# Altium project MAINBOARD.PrjPcb (part 1 of 2)
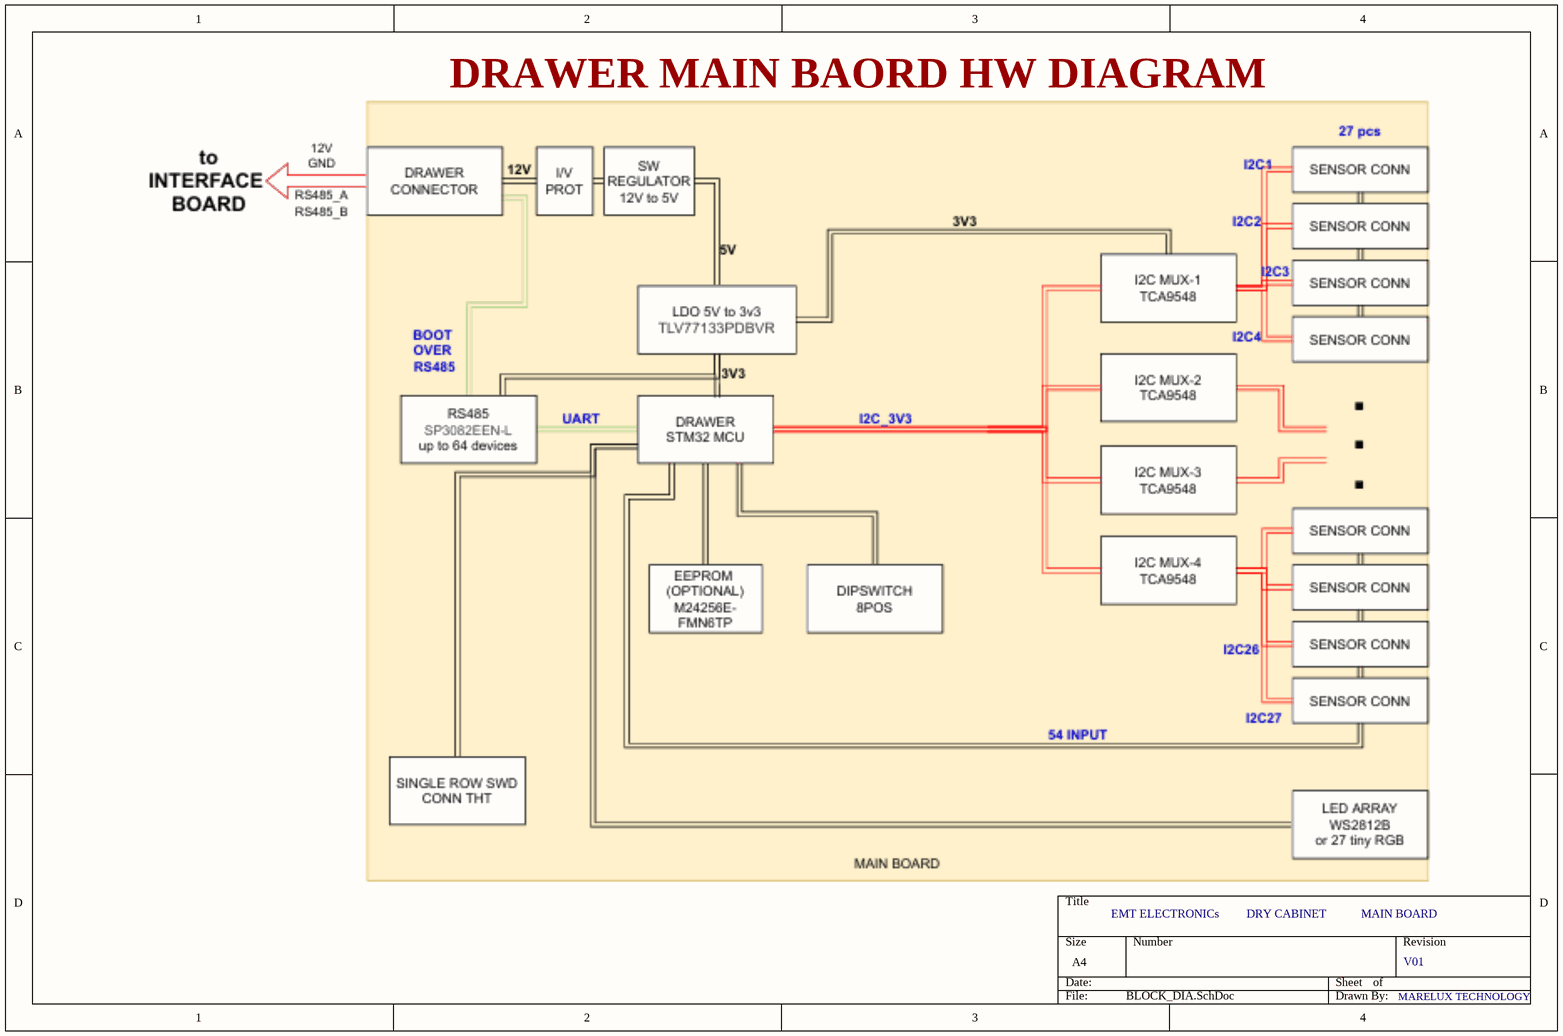
[diagram p0: BLOCK_DIA.SchDoc]
CUSTOMER: EMT ELECTRONICs; DATE(MONTH): JULY; DESIGNER: MARELUX TECHNOLOGY; HARDWARE: MAIN BOARD; PROJECT: DRY CABINET; VERSION: V01
9 sheets, 399 parts. Net scope: flat (ports and power ports of the same name join across sheets).
Board file: MAINBOARD_PCB.PcbDoc
Sheets:
  BLOCK_DIA.SchDoc
  POWER.SchDoc
  MICROCONTROLLER.SchDoc
  I2C SWITCH.SchDoc
  RGB LEDs.SchDoc
  RGB_LED_2.SchDoc
  RGB_LED_3.SchDoc
  MISC.SchDoc
  CONNECTORs.SchDoc

## Sheet BLOCK_DIA.SchDoc
size A4

### Notes on the sheet
- DRAWER MAIN BAORD HW DIAGRAM

## Sheet POWER.SchDoc
size A4
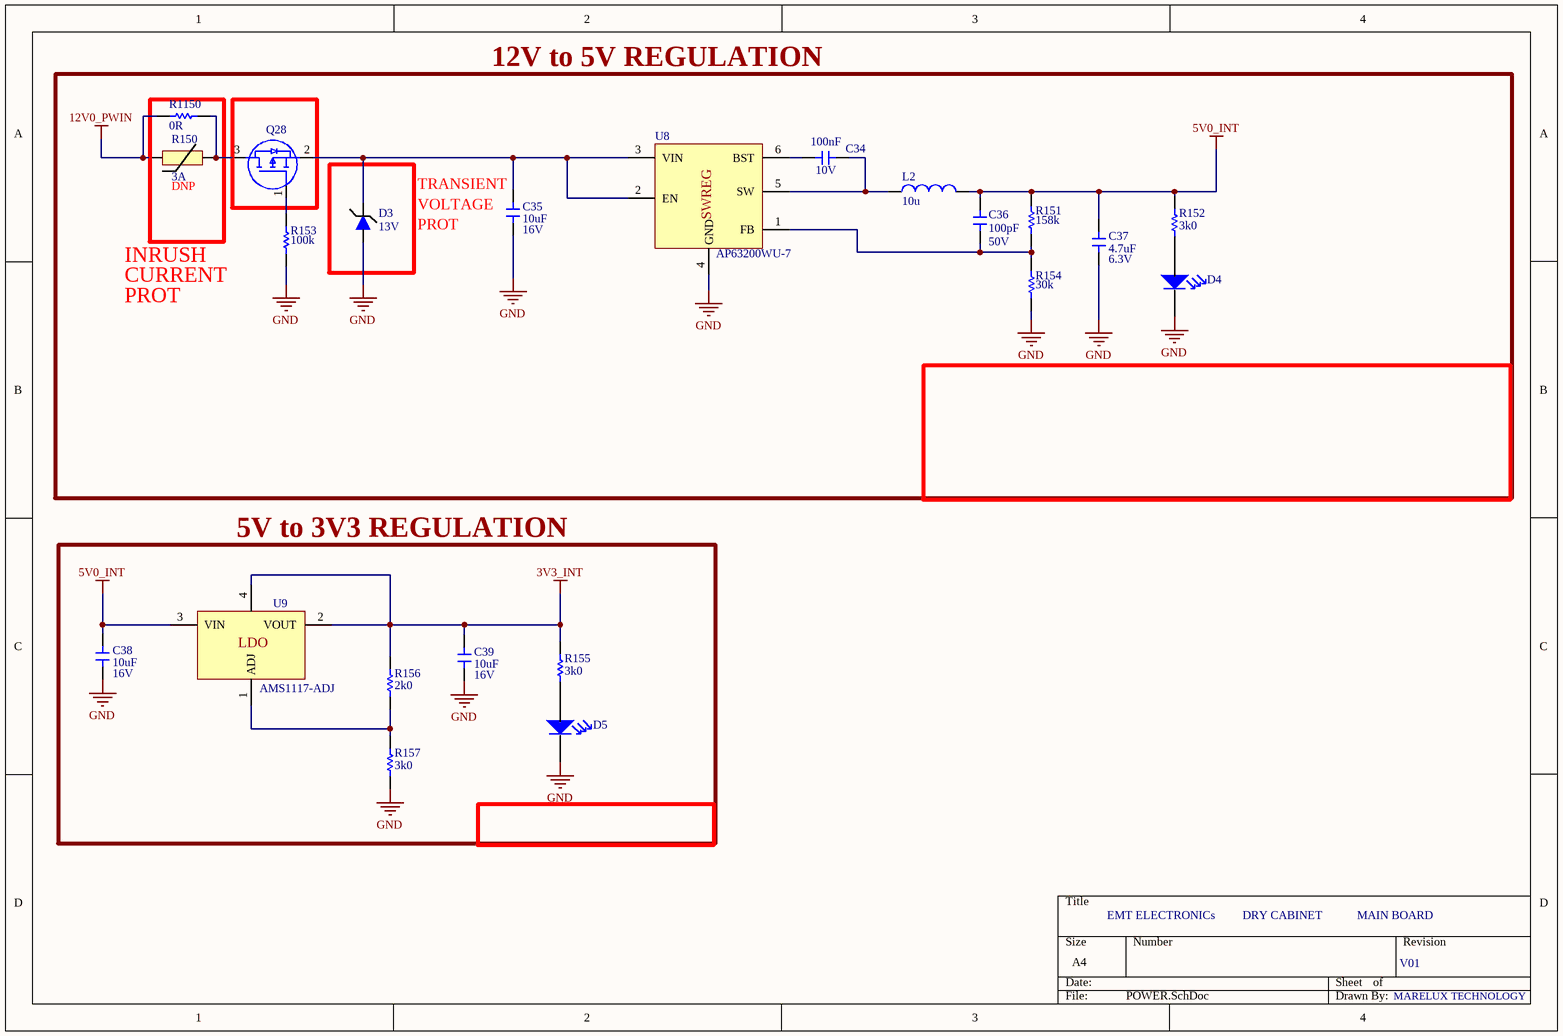
[diagram p1: POWER.SchDoc]

### Parts
C34  value 100nF  Voltage: 10V  [CAP_0402_CER]  (hidden comment: CL05B104KP5NNNC)
C35  value 10uF  Voltage: 16V  [CAP_0805_CER]  (hidden comment: CL21A106KOQNNNE)
C36  value 100pF  Voltage: 50V  [CAP_0402_CER]  (hidden comment: CC0402JRNPO9BN101)
C37  value 4.7uF  Voltage: 6.3V  [CAP_0603_CER]  (hidden comment: CL10A475KP8NNNC)
C38  value 10uF  Voltage: 16V  [CAP_0805_CER]  (hidden comment: CL21A106KOQNNNE)
C39  value 10uF  Voltage: 16V  [CAP_0805_CER]  (hidden comment: CL21A106KOQNNNE)
D3  value 13V  [SOD-123F]  (hidden comment: SMF13A)
D4  HSMM-C170  [LED_0805_SMD]  (value not drawn)
D5  HSMM-C170  [LED_0805_SMD]  (value not drawn)
L2  value 10u  [IND_YAGEO]  (hidden comment: BMRB00060630100MA1)
Q28  GSF3407  [SOT-23]  (value not drawn)
R150  value 3A  Place: DNP  [MF72-005D9]  (hidden comment: MF72-005D9)  (no BOM)
R151  value 158k  [RES_0402_SMD]  (hidden comment: RMCF0402FT158K)
R152  value 3k0  [RES_0402_SMD]  (hidden comment: RMCF0402FT3K00)
R153  value 100k  [RES_0402_SMD]  (hidden comment: RMCF0402JT100K)
R154  value 30k  [RES_0402_SMD]  (hidden comment: RMCF0402JT30K0)
R155  value 3k0  [RES_0402_SMD]  (hidden comment: RMCF0402FT3K00)
R156  value 2k0  [RES_0402_SMD]  (hidden comment: RMCF0402FT2K00)
R157  value 3k0  [RES_0402_SMD]  (hidden comment: RMCF0402FT3K00)
R1150  0R  [RES_1206_SMD]
U8  AP63200WU-7  [TSOT-23-6]
U9  AMS1117-ADJ  [SOT-223-3]

### Blocks framed on the sheet
12V to 5V REGULATION: C34-C37 D3 D4 L2 Q28 R150-R154 R1150 U8
5V to 3V3 REGULATION: C38 C39 D5 R155-R157 U9

### Nets
3V3_INT: C39.2 R155.2 R156.2 U9.2(VOUT) U9.4(OUT)
5V0_INT: C36.1 C37.2 C38.2 L2.2 R151.2 R152.2 U9.3(VIN)
12V0_PWIN: R150.1 R1150.1
GND: C35.1 C37.1 C38.1 C39.1 D3.2(A) D4.C D5.C R153.1 R154.1 R157.1 U8.4(GND)
NetC34_1: C34.1 L2.1 U8.5(SW)
NetC34_2: C34.2 U8.6(BST)
NetC35_2: C35.2 D3.1(C) Q28.2(S) U8.2(EN) U8.3(VIN)
NetC36_2: C36.2 R151.1 R154.2 U8.1(FB)
NetD4_A: D4.A R152.1
NetD5_A: D5.A R155.1
NetQ28_1: Q28.1(G) R153.2
NetQ28_3: Q28.3(D) R150.2 R1150.2
NetR156_1: R156.1 R157.2 U9.1(ADJ)

### Notes on the sheet
- (near C35) TRANSIENT
- VOLTAGE
- PROT
- INRUSH
- CURRENT
- (in symbol AMS1117-ADJ) LDO
- (in symbol AP63200WU-7) SWREG

### Library data of the parts
C34 = CAP_GEN_CER: 100nF 0402 Ceramic Capacitor; Place: POP; Part Number: CL05B104KP5NNNC; Power: *; Package: *; Tolerance: *; Operating Temp.: *
C35 C38 C39 = CAP_GEN_CER: 10uF 0805 Ceramic Capacitor; Place: POP; Part Number: CL21A106KOQNNNE; Power: *; Package: *; Tolerance: *; Operating Temp.: *
C36 = CAP_GEN_CER: 100pF 0402 Ceramic Capacitor; Place: POP; Part Number: CC0402JRNPO9BN101; Power: *; Package: *; Tolerance: *; Operating Temp.: *
C37 = CAP_GEN_CER: 4,7uF 0603 Ceramic Capacitor; Place: POP; Part Number: CL10A475KP8NNNC; Power: *; Package: *; Tolerance: *; Operating Temp.: *
D3 = SMF13A: TVS DIODE 200W 14.4V-15.9V SOD-123; Manufacturer: ANBON SEMI; Voltage: 14.4V; Place: POP; Part Number: SMF13A; Power: 200W; Tolerance: N/A; Package: SOD-123F; Operating Temp.: -55°C ~ 150°C
D4 D5 = LED_GEN: Manufacturer: Broadcom; Voltage: 3.3V; Place: POP; Part Number: HSMM-C170; Value: *; Power: *; Tolerance: *; Package: 0805; Operating Temp.: *
L2 = BMRB00060630100MA1: FIXED IND 10UH 4A 68 MOHM SMD; Manufacturer: PULSE; Place: POP; Current: 4; Tolerance: ±20%; Part Number: BMRB00060630100MA1; Power: N/A; Package: IND_YAGEO; Operating Temp.: -55°C ~ 125°C
Q28 = GSF3407: P-Channel 30 V 4.1A (Ta) 1.2W (Ta) Surface Mount SOT-23; Manufacturer: Good-Ark Semiconductor; Voltage: 30 V; Power: 1200 mW; Place: POP; Part Number: GSF3407; Value: N/A; Tolerance: N/A; Package: SOT-23; Operating Temp.: -55°C ~ 150°C
R150 = MF72-005D9: Inrush Current Limiter 5 Ohms ±20% 3 A; Manufacturer: Cantherm; Tolerance: 20; Part Number: MF72-005D9; Voltage: N/A; Power: N/A; Package: MF72-005D9; Operating Temp.: -65°C ~ 150°C
R151 = RES_GEN_SMD: Generic Chip Res 158k; Tolerance: 1%; Place: POP; Package: 0402; Part Number: RMCF0402FT158K; Power: *; Voltage: *; Operating Temp.: *
R152 R155 R157 = RES_GEN_SMD: Generic Chip Res 3k0; Tolerance: 1 %; Place: POP; Package: *; Part Number: RMCF0402FT3K00; Power: *; Voltage: *; Operating Temp.: *
R153 = RES_GEN_SMD: Generic Chip Res 158k; Tolerance: 5%; Place: POP; Package: 0402; Part Number: RMCF0402JT100K; Power: *; Voltage: *; Operating Temp.: *
R154 = RES_GEN_SMD: Generic Chip Res 30k; Tolerance: 5%; Place: POP; Package: 0402; Part Number: RMCF0402JT30K0; Power: *; Voltage: *; Operating Temp.: *
R156 = RES_GEN_SMD: Generic Chip Res 2k0; Tolerance: 1 %; Place: POP; Package: *; Part Number: RMCF0402FT2K00; Power: *; Voltage: *; Operating Temp.: *
R1150 = RES_GEN_SMD: Generic Chip Res 0R; Package: *; Part Number: *; Power: *; Tolerance: *; Value: 0R; Voltage: *; Operating Temp.: *; Place: *
U8 = AP63200WU-7: IC REG BUCK ADJ 2A TSOT23-6 / 3.8V to 32V; Manufacturer: Diodes Incorporated; Operatin Temp.: -40°C ~ 85; Place: POP; Part Number: AP63200WU-7; Value: N/A; Voltage: ADJ; Power: N/A; Tolerance: N/A; Package: TSOT-23-6
U9 = AMS1117-ADJ: IC LDO REG ADJ 1A SOT223; Manufacturer: EVVO; Place: POP; Part Number: AMS1117-ADJ; Value: 1A; Voltage: ADJ; Power: N/A; Tolerance: N/A; Package: SOT-223-3; Operating Temp.: -40°C ~ 85°C

## Sheet MICROCONTROLLER.SchDoc
size A4 portrait
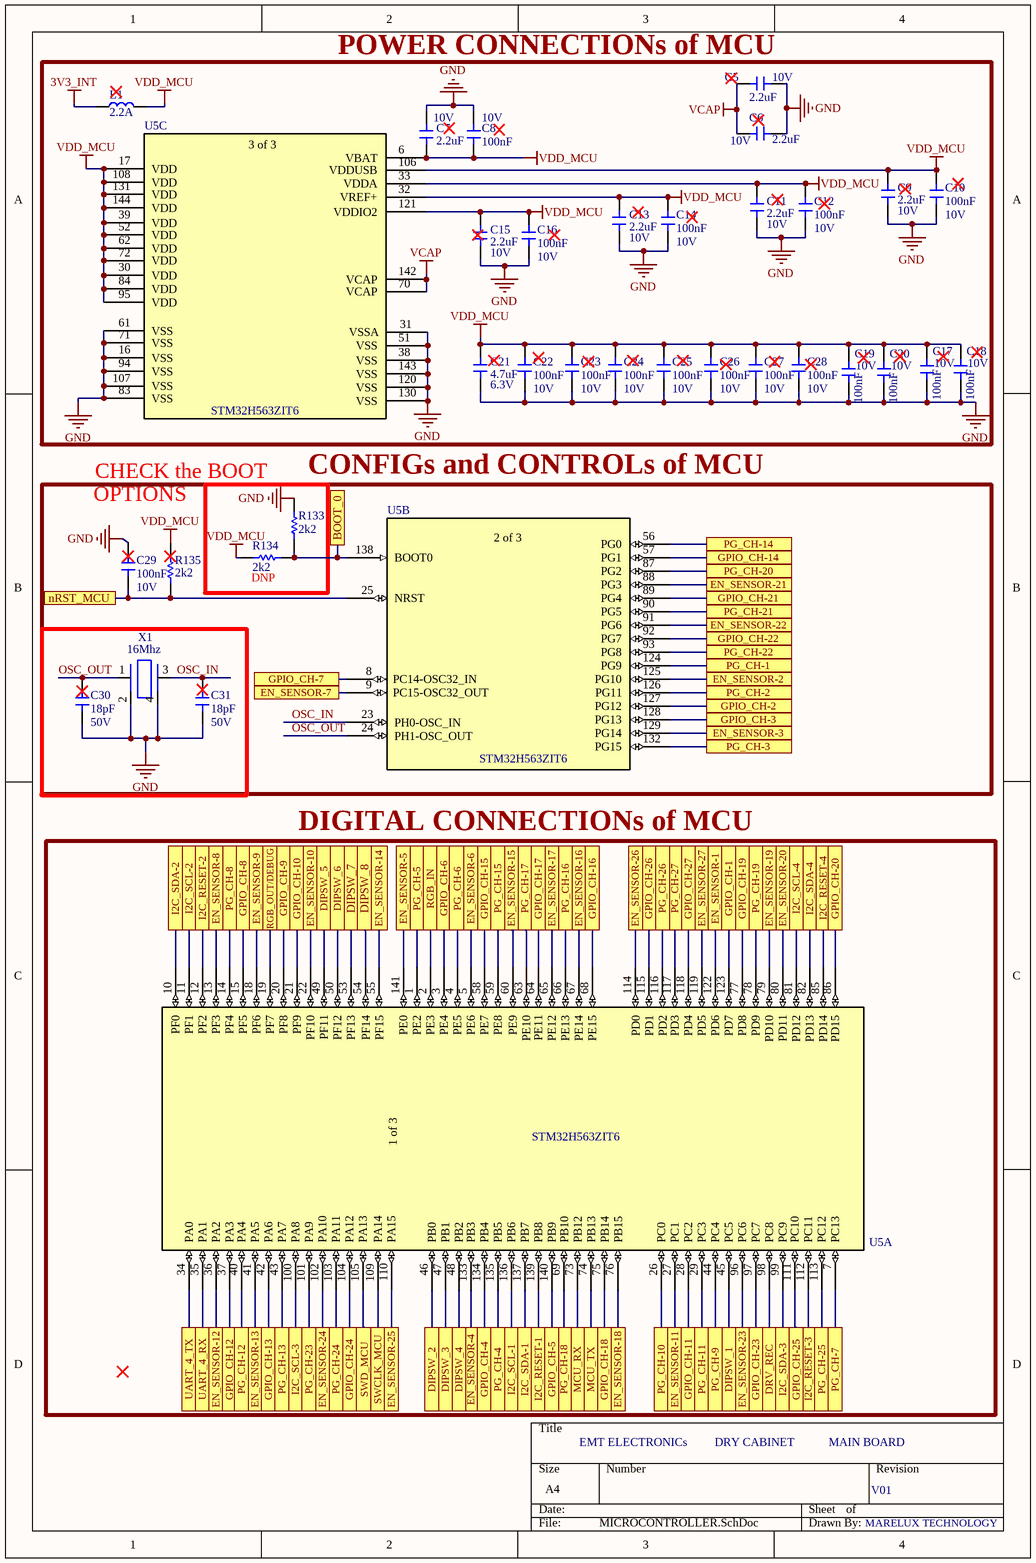
[diagram p2: MICROCONTROLLER.SchDoc]

### Parts
C5  value 2.2uF  Voltage: 10V  [CAP_0603_CER]  (hidden comment: CL10A225KP8NNNC)
C6  value 2.2uF  Voltage: 10V  [CAP_0603_CER]  (hidden comment: CL10A225KP8NNNC)
C7  value 2.2uF  Voltage: 10V  [CAP_0603_CER]  (hidden comment: CL10A225KP8NNNC)
C8  value 100nF  Voltage: 10V  [CAP_0402_CER]  (hidden comment: CL05B104KP5NNNC)
C9  value 2.2uF  Voltage: 10V  [CAP_0603_CER]  (hidden comment: CL10A225KP8NNNC)
C10  value 100nF  Voltage: 10V  [CAP_0402_CER]  (hidden comment: CL05B104KP5NNNC)
C11  value 2.2uF  Voltage: 10V  [CAP_0603_CER]  (hidden comment: CL10A225KP8NNNC)
C12  value 100nF  Voltage: 10V  [CAP_0402_CER]  (hidden comment: CL05B104KP5NNNC)
C13  value 2.2uF  Voltage: 10V  [CAP_0603_CER]  (hidden comment: CL10A225KP8NNNC)
C14  value 100nF  Voltage: 10V  [CAP_0402_CER]  (hidden comment: CL05B104KP5NNNC)
C15  value 2.2uF  Voltage: 10V  [CAP_0603_CER]  (hidden comment: CL10A225KP8NNNC)
C16  value 100nF  Voltage: 10V  [CAP_0402_CER]  (hidden comment: CL05B104KP5NNNC)
C17  value 100nF  Voltage: 10V  [CAP_0402_CER]  (hidden comment: CL05B104KP5NNNC)
C18  value 100nF  Voltage: 10V  [CAP_0402_CER]  (hidden comment: CL05B104KP5NNNC)
C19  value 100nF  Voltage: 10V  [CAP_0402_CER]  (hidden comment: CL05B104KP5NNNC)
C20  value 100nF  Voltage: 10V  [CAP_0402_CER]  (hidden comment: CL05B104KP5NNNC)
C21  value 4.7uF  Voltage: 6.3V  [CAP_0603_CER]  (hidden comment: CL10A475KP8NNNC)
C22  value 100nF  Voltage: 10V  [CAP_0402_CER]  (hidden comment: CL05B104KP5NNNC)
C23  value 100nF  Voltage: 10V  [CAP_0402_CER]  (hidden comment: CL05B104KP5NNNC)
C24  value 100nF  Voltage: 10V  [CAP_0402_CER]  (hidden comment: CL05B104KP5NNNC)
C25  value 100nF  Voltage: 10V  [CAP_0402_CER]  (hidden comment: CL05B104KP5NNNC)
C26  value 100nF  Voltage: 10V  [CAP_0402_CER]  (hidden comment: CL05B104KP5NNNC)
C27  value 100nF  Voltage: 10V  [CAP_0402_CER]  (hidden comment: CL05B104KP5NNNC)
C28  value 100nF  Voltage: 10V  [CAP_0402_CER]  (hidden comment: CL05B104KP5NNNC)
C29  value 100nF  Voltage: 10V  [CAP_0402_CER]  (hidden comment: CL05B104KP5NNNC)
C30  value 18pF  Voltage: 50V  [CAP_0402_CER]  (hidden comment: CC0402JRNPO9BN180)
C31  value 18pF  Voltage: 50V  [CAP_0402_CER]  (hidden comment: CC0402JRNPO9BN180)
L1  Power: 2.2A  [IND_0603_SMD]  (hidden comment: MPZ1608S221ATA00)
R133  value 2k2  [RES_0402_SMD]  (hidden comment: RMCF0402JT2K20)
R134  value 2k2  Place: DNP  [RES_0402_SMD]  (hidden comment: RMCF0402JT2K20)  (no BOM)
R135  value 2k2  [RES_0402_SMD]  (hidden comment: RMCF0402JT2K20)
U5  STM32H563ZIT6  [LQFP-144]  (parts A,B,C of 3)
X1  value 16Mhz  [XTAL-4SMD]  (hidden comment: CF4016M00009T1521005)

### Blocks framed on the sheet
POWER CONNECTIONs of MCU: C5-C28 L1 U5
CONFIGs and CONTROLs of MCU: R133 R134
DIGITAL CONNECTIONs of MCU: U5

### Ports
BOOT_0, DIPSW_1, DIPSW_2, DIPSW_3, DIPSW_4, DIPSW_5, DIPSW_6, DIPSW_7, DIPSW_8, DRV_REC, EN_SENSOR-1, EN_SENSOR-2, EN_SENSOR-3, EN_SENSOR-4, EN_SENSOR-5, EN_SENSOR-6, EN_SENSOR-7, EN_SENSOR-8, EN_SENSOR-9, EN_SENSOR-10, EN_SENSOR-11, EN_SENSOR-12, EN_SENSOR-13, EN_SENSOR-14, EN_SENSOR-15, EN_SENSOR-16, EN_SENSOR-17, EN_SENSOR-18, EN_SENSOR-19, EN_SENSOR-20, EN_SENSOR-21, EN_SENSOR-22, EN_SENSOR-23, EN_SENSOR-24, EN_SENSOR-25, EN_SENSOR-26, EN_SENSOR-27, GPIO_CH-1, GPIO_CH-2, GPIO_CH-3, GPIO_CH-4, GPIO_CH-5, GPIO_CH-6, GPIO_CH-7, GPIO_CH-8, GPIO_CH-9, GPIO_CH-10, GPIO_CH-11, GPIO_CH-12, GPIO_CH-13, GPIO_CH-14, GPIO_CH-15, GPIO_CH-16, GPIO_CH-17, GPIO_CH-18, GPIO_CH-19, GPIO_CH-20, GPIO_CH-21, GPIO_CH-22, GPIO_CH-23, GPIO_CH-24, GPIO_CH-25, GPIO_CH-26, GPIO_CH-27, I2C_RESET-1, I2C_RESET-2, I2C_RESET-3, I2C_RESET-4, I2C_SCL-1, I2C_SCL-2, I2C_SCL-3, I2C_SCL-4, I2C_SDA-1, I2C_SDA-2, I2C_SDA-3, I2C_SDA-4, MCU_RX, MCU_TX, nRST_MCU, PG_CH-1, PG_CH-2, PG_CH-3, PG_CH-4, PG_CH-5, PG_CH-6, PG_CH-7, PG_CH-8, PG_CH-9, PG_CH-10, PG_CH-11, PG_CH-12, PG_CH-13, PG_CH-14, PG_CH-15, PG_CH-16, PG_CH-17, PG_CH-18, PG_CH-19, PG_CH-20, PG_CH-21, PG_CH-22, PG_CH-23, PG_CH-24, PG_CH-25, PG_CH-26, PG_CH-27, RGB_IN, RGB_OUT/DEBUG, SWCLK_MCU, SWD_MCU, UART_4_RX, UART_4_TX

### Nets
3V3_INT: L1.1
GND: C5.1 C6.1 C7.2 C8.1 C9.1 C10.2 C11.1 C12.2 C13.1 C14.2 C15.1 C16.2 C17.2 C18.2 C19.2 C20.2 C21.1 C22.2 C23.2 C24.2 C25.2 C26.2 C27.2 C28.2 C29.1 C30.2 C31.2 R133.1 U5.16(VSS) U5.31(VSSA) U5.38(VSS) U5.51(VSS) U5.61(VSS) U5.71(VSS) U5.83(VSS) U5.94(VSS) U5.107(VSS) U5.120(VSS) U5.130(VSS) U5.143(VSS) X1.2 X1.4
VCAP: C5.2 C6.2 U5.70(VCAP) U5.142(VCAP)
VDD_MCU: C7.1 C8.2 C9.2 C10.1 C11.2 C12.1 C13.2 C14.1 C15.2 C16.1 C17.1 C18.1 C19.1 C20.1 C21.2 C22.1 C23.1 C24.1 C25.1 C26.1 C27.1 C28.1 L1.2 R134.2 R135.2 U5.6(VBAT) U5.17(VDD) U5.30(VDD) U5.32(VREF+) U5.33(VDDA) U5.39(VDD) U5.52(VDD) U5.62(VDD) U5.72(VDD) U5.84(VDD) U5.95(VDD) U5.106(VDDUSB) U5.108(VDD) U5.121(VDDIO2) U5.131(VDD) U5.144(VDD)
I2C_SCL-1: U5.136(PB6) ; port I2C_SCL-1
I2C_SCL-2: U5.11(PF1) ; port I2C_SCL-2
I2C_SCL-3: U5.100(PA8) ; port I2C_SCL-3
I2C_SCL-4: U5.81(PD12) ; port I2C_SCL-4
I2C_SDA-1: U5.137(PB7) ; port I2C_SDA-1
I2C_SDA-2: U5.10(PF0) ; port I2C_SDA-2
I2C_SDA-3: U5.99(PC9) ; port I2C_SDA-3
I2C_SDA-4: U5.82(PD13) ; port I2C_SDA-4
OSC_IN: C31.1 U5.23(PH0-OSC_IN) X1.3
OSC_OUT: C30.1 U5.24(PH1-OSC_OUT) X1.1
NetC29_2: C29.2 R135.1 U5.25(NRST) ; port nRST_MCU
NetDEVICE_ID_1: U5.45(PC5) ; port DIPSW_1
NetDEVICE_ID_2: U5.46(PB0) ; port DIPSW_2
NetDEVICE_ID_3: U5.47(PB1) ; port DIPSW_3
NetDEVICE_ID_4: U5.48(PB2) ; port DIPSW_4
NetDEVICE_ID_5: U5.49(PF11) ; port DIPSW_5
NetDEVICE_ID_6: U5.50(PF12) ; port DIPSW_6
NetDEVICE_ID_7: U5.53(PF13) ; port DIPSW_7
NetDEVICE_ID_8: U5.54(PF14) ; port DIPSW_8
NetJ1_3: U5.123(PD7) ; port GPIO_CH-1
NetJ1_5: U5.124(PG9) ; port PG_CH-1
NetJ2_3: U5.127(PG12) ; port GPIO_CH-2
NetJ2_5: U5.126(PG11) ; port PG_CH-2
NetJ3_3: U5.128(PG13) ; port GPIO_CH-3
NetJ3_5: U5.132(PG15) ; port PG_CH-3
NetJ4_3: U5.134(PB4) ; port GPIO_CH-4
NetJ4_5: U5.135(PB5) ; port PG_CH-4
NetJ5_3: U5.140(PB9) ; port GPIO_CH-5
NetJ5_5: U5.1(PE2) ; port PG_CH-5
NetJ6_3: U5.3(PE4) ; port GPIO_CH-6
NetJ6_5: U5.4(PE5) ; port PG_CH-6
NetJ7_3: U5.8(PC14-OSC32_IN) ; port GPIO_CH-7
NetJ7_5: U5.7(PC13) ; port PG_CH-7
NetJ8_3: U5.15(PF5) ; port GPIO_CH-8
NetJ8_5: U5.14(PF4) ; port PG_CH-8
NetJ9_3: U5.20(PF8) ; port GPIO_CH-9
NetJ9_5: U5.44(PC4) ; port PG_CH-9
NetJ10_3: U5.21(PF9) ; port GPIO_CH-10
NetJ10_5: U5.26(PC0) ; port PG_CH-10
NetJ11_3: U5.28(PC2) ; port GPIO_CH-11
NetJ11_5: U5.29(PC3) ; port PG_CH-11
NetJ12_3: U5.37(PA3) ; port GPIO_CH-12
NetJ12_5: U5.40(PA4) ; port PG_CH-12
NetJ13_3: U5.42(PA6) ; port GPIO_CH-13
NetJ13_5: U5.43(PA7) ; port PG_CH-13
NetJ14_3: U5.57(PG1) ; port GPIO_CH-14
NetJ14_5: U5.56(PG0) ; port PG_CH-14
NetJ15_3: U5.58(PE7) ; port GPIO_CH-15
NetJ15_5: U5.59(PE8) ; port PG_CH-15
NetJ16_3: U5.68(PE15) ; port GPIO_CH-16
NetJ16_5: U5.66(PE13) ; port PG_CH-16
NetJ17_3: U5.64(PE11) ; port GPIO_CH-17
NetJ17_5: U5.63(PE10) ; port PG_CH-17
NetJ18_3: U5.75(PB14) ; port GPIO_CH-18
NetJ18_5: U5.69(PB10) ; port PG_CH-18
NetJ19_3: U5.77(PD8) ; port GPIO_CH-19
NetJ19_5: U5.78(PD9) ; port PG_CH-19
NetJ20_3: U5.86(PD15) ; port GPIO_CH-20
NetJ20_5: U5.87(PG2) ; port PG_CH-20
NetJ21_3: U5.89(PG4) ; port GPIO_CH-21
NetJ21_5: U5.90(PG5) ; port PG_CH-21
NetJ22_3: U5.92(PG7) ; port GPIO_CH-22
NetJ22_5: U5.93(PG8) ; port PG_CH-22
NetJ23_3: U5.97(PC7) ; port GPIO_CH-23
NetJ23_5: U5.101(PA9) ; port PG_CH-23
NetJ24_3: U5.104(PA12) ; port GPIO_CH-24
NetJ24_5: U5.103(PA11) ; port PG_CH-24
NetJ25_3: U5.111(PC10) ; port GPIO_CH-25
NetJ25_5: U5.113(PC12) ; port PG_CH-25
NetJ26_3: U5.115(PD1) ; port GPIO_CH-26
NetJ26_5: U5.116(PD2) ; port PG_CH-26
NetJ27_3: U5.118(PD4) ; port GPIO_CH-27
NetJ27_5: U5.117(PD3) ; port PG_CH-27
NetJ_BOS_2: U5.109(PA14) ; port SWCLK_MCU
NetJ_BOS_3: U5.105(PA13) ; port SWD_MCU
NetJ_EXTRA_2: U5.34(PA0) ; port UART_4_TX
NetJ_EXTRA_3: U5.35(PA1) ; port UART_4_RX
NetJ_EXTRA_4: R133.2 R134.1 U5.138(BOOT0) ; port BOOT_0
NetR10_2: U5.122(PD6) ; port EN_SENSOR-1
NetR11_2: U5.125(PG10) ; port EN_SENSOR-2
NetR12_2: U5.129(PG14) ; port EN_SENSOR-3
NetR22_2: U5.133(PB3) ; port EN_SENSOR-4
NetR23_2: U5.141(PE0) ; port EN_SENSOR-5
NetR24_2: U5.5(PE6) ; port EN_SENSOR-6
NetR34_2: U5.9(PC15-OSC32_OUT) ; port EN_SENSOR-7
NetR35_2: U5.13(PF3) ; port EN_SENSOR-8
NetR36_2: U5.18(PF6) ; port EN_SENSOR-9
NetR46_2: U5.22(PF10) ; port EN_SENSOR-10
NetR47_2: U5.27(PC1) ; port EN_SENSOR-11
NetR48_2: U5.36(PA2) ; port EN_SENSOR-12
NetR58_2: U5.41(PA5) ; port EN_SENSOR-13
NetR59_2: U5.55(PF15) ; port EN_SENSOR-14
NetR60_2: U5.60(PE9) ; port EN_SENSOR-15
NetR70_2: U5.67(PE14) ; port EN_SENSOR-16
NetR71_2: U5.65(PE12) ; port EN_SENSOR-17
NetR72_2: U5.76(PB15) ; port EN_SENSOR-18
NetR82_2: U5.79(PD10) ; port EN_SENSOR-19
NetR83_2: U5.80(PD11) ; port EN_SENSOR-20
NetR84_2: U5.88(PG3) ; port EN_SENSOR-21
NetR94_2: U5.91(PG6) ; port EN_SENSOR-22
NetR95_2: U5.96(PC6) ; port EN_SENSOR-23
NetR96_2: U5.102(PA10) ; port EN_SENSOR-24
NetR106_2: U5.110(PA15) ; port EN_SENSOR-25
NetR107_2: U5.114(PD0) ; port EN_SENSOR-26
NetR108_2: U5.119(PD5) ; port EN_SENSOR-27
NetR147_2: U5.73(PB12) ; port MCU_RX
NetR148_2: U5.74(PB13) ; port MCU_TX
NetR149_2: U5.98(PC8) ; port DRV_REC
NetR158_2: U5.2(PE3) ; port RGB_IN
NetR168_2: U5.19(PF7) ; port RGB_OUT/DEBUG
NetU1_3: U5.139(PB8) ; port I2C_RESET-1
NetU2_3: U5.12(PF2) ; port I2C_RESET-2
NetU3_3: U5.112(PC11) ; port I2C_RESET-3
NetU4_3: U5.85(PD14) ; port I2C_RESET-4

### Notes on the sheet
- OPTIONS
- CHECK the BOOT
- (in symbol STM32H563ZIT6, part A) 1 of 3
- (in symbol STM32H563ZIT6, part B) 2 of 3
- (in symbol STM32H563ZIT6, part C) 3 of 3

### Library data of the parts
C5-C7 C9 C11 C13 C15 = CAP_GEN_CER: 2.2uF 0603 Ceramic Capacitor; Place: POP; Part Number: CL10A225KP8NNNC; Power: *; Package: *; Tolerance: *; Operating Temp.: *
C8 C10 C12 C14 C16-C20 C22-C29 = CAP_GEN_CER: 100nF 0402 Ceramic Capacitor; Place: POP; Part Number: CL05B104KP5NNNC; Power: *; Package: *; Tolerance: *; Operating Temp.: *
C21 = CAP_GEN_CER: 4,7uF 0603 Ceramic Capacitor; Place: POP; Part Number: CL10A475KP8NNNC; Power: *; Package: *; Tolerance: *; Operating Temp.: *
C30 C31 = CAP_GEN_CER: 18pF 0402 Ceramic Capacitor; Place: POP; Part Number: CC0402JRNPO9BN180; Power: *; Package: *; Tolerance: *; Operating Temp.: *
L1 = IND_GEN_SMD: Generic SMD IND/BEAD; Manufacturer: TDK; Value: 220 Ohms @ 100 MHz; Place: POP; Part Number: MPZ1608S221ATA00; Package: 0603; Tolerance: N/A; Voltage: N/A; Operating Temp.: -55°C ~ 125°C
R133 R135 = RES_GEN_SMD: Generic Chip Res 2k2; Tolerance: 5 %; Place: POP; Package: *; Part Number: RMCF0402JT2K20; Power: *; Voltage: *; Operating Temp.: *
R134 = RES_GEN_SMD: Generic Chip Res 2k2; Tolerance: 5 %; Package: *; Part Number: RMCF0402JT2K20; Power: *; Voltage: *; Operating Temp.: *
U5 = STM32H563ZIT6: ARM® Cortex®-M33 STM32H5 Microcontroller IC 32-Bit 250MHz 2MB (2M x 8) FLASH 144-LQFP (20x20) / ); Manufacturer: STM; Voltage: 1.7-3.6 V; Operatin Temp.: -40°C ~ 85°; Place: P; Part Number: STM32H563ZIT6; Value: N/A; Power: N/A; Tolerance: N/A; Package: LQFP-144
X1 = XTAL-4PINs: 16 MHz ±10ppm Crystal 9pF 40 Ohms 4-SMD, No Lead; Manufacturer: Hefei Jingweite Electronics Co., Ltd.; Place: POP; Voltage: N/A; Tolerance: ±10ppm; Power: N/A; Part Number: CF4016M00009T1521005; Operating Temp.: -40°C ~ 125°C

## Sheet I2C SWITCH.SchDoc
size A4 portrait
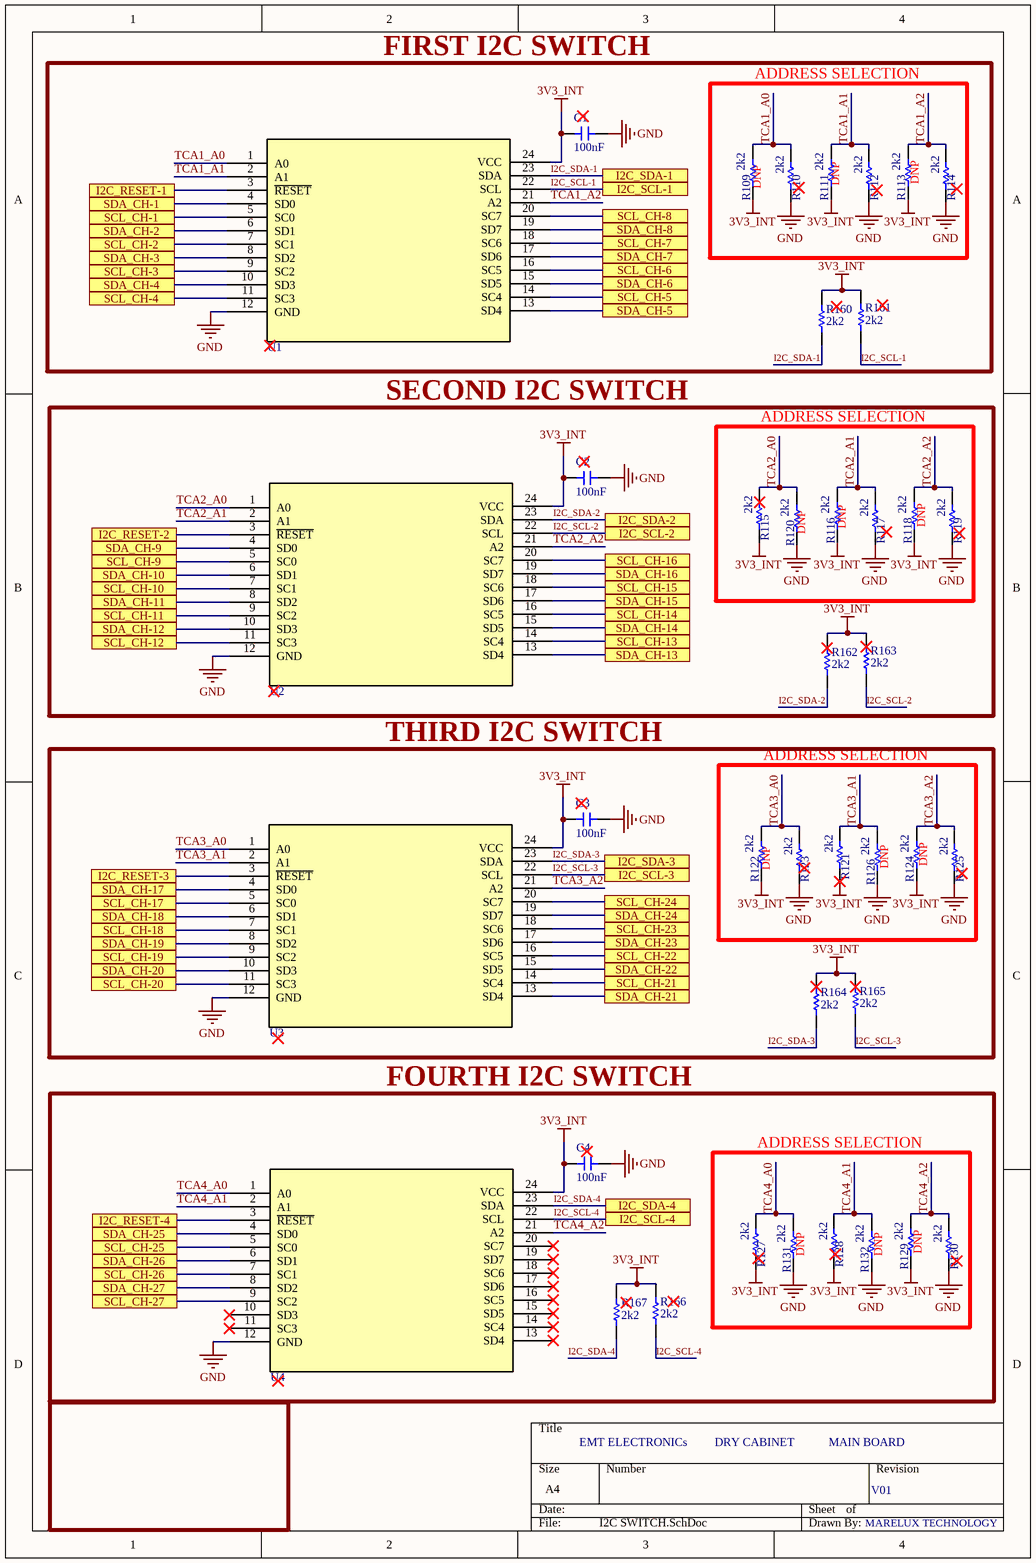
[diagram p3: I2C SWITCH.SchDoc]

### Parts
C1  value 100nF  [CAP_0402_CER]  (hidden comment: CL05B104KP5NNNC)
C2  value 100nF  [CAP_0402_CER]  (hidden comment: CL05B104KP5NNNC)
C3  value 100nF  [CAP_0402_CER]  (hidden comment: CL05B104KP5NNNC)
C4  value 100nF  [CAP_0402_CER]  (hidden comment: CL05B104KP5NNNC)
R109  value 2k2  Place: DNP  [RES_0402_SMD]  (hidden comment: RMCF0402JT2K20)  (no BOM)
R110  value 2k2  [RES_0402_SMD]  (hidden comment: RMCF0402JT2K20)
R111  value 2k2  Place: DNP  [RES_0402_SMD]  (hidden comment: RMCF0402JT2K20)  (no BOM)
R112  value 2k2  [RES_0402_SMD]  (hidden comment: RMCF0402JT2K20)
R113  value 2k2  Place: DNP  [RES_0402_SMD]  (hidden comment: RMCF0402JT2K20)  (no BOM)
R114  value 2k2  [RES_0402_SMD]  (hidden comment: RMCF0402JT2K20)
R115  value 2k2  [RES_0402_SMD]  (hidden comment: RMCF0402JT2K20)
R116  value 2k2  Place: DNP  [RES_0402_SMD]  (hidden comment: RMCF0402JT2K20)  (no BOM)
R117  value 2k2  [RES_0402_SMD]  (hidden comment: RMCF0402JT2K20)
R118  value 2k2  Place: DNP  [RES_0402_SMD]  (hidden comment: RMCF0402JT2K20)  (no BOM)
R119  value 2k2  [RES_0402_SMD]  (hidden comment: RMCF0402JT2K20)
R120  value 2k2  Place: DNP  [RES_0402_SMD]  (hidden comment: RMCF0402JT2K20)  (no BOM)
R121  value 2k2  [RES_0402_SMD]  (hidden comment: RMCF0402JT2K20)
R122  value 2k2  Place: DNP  [RES_0402_SMD]  (hidden comment: RMCF0402JT2K20)  (no BOM)
R123  value 2k2  [RES_0402_SMD]  (hidden comment: RMCF0402JT2K20)
R124  value 2k2  Place: DNP  [RES_0402_SMD]  (hidden comment: RMCF0402JT2K20)  (no BOM)
R125  value 2k2  [RES_0402_SMD]  (hidden comment: RMCF0402JT2K20)
R126  value 2k2  Place: DNP  [RES_0402_SMD]  (hidden comment: RMCF0402JT2K20)  (no BOM)
R127  value 2k2  [RES_0402_SMD]  (hidden comment: RMCF0402JT2K20)
R128  value 2k2  [RES_0402_SMD]  (hidden comment: RMCF0402JT2K20)
R129  value 2k2  Place: DNP  [RES_0402_SMD]  (hidden comment: RMCF0402JT2K20)  (no BOM)
R130  value 2k2  [RES_0402_SMD]  (hidden comment: RMCF0402JT2K20)
R131  value 2k2  Place: DNP  [RES_0402_SMD]  (hidden comment: RMCF0402JT2K20)  (no BOM)
R132  value 2k2  Place: DNP  [RES_0402_SMD]  (hidden comment: RMCF0402JT2K20)  (no BOM)
R160  value 2k2  [RES_0402_SMD]  (hidden comment: RMCF0402JT2K20)
R161  value 2k2  [RES_0402_SMD]  (hidden comment: RMCF0402JT2K20)
R162  value 2k2  [RES_0402_SMD]  (hidden comment: RMCF0402JT2K20)
R163  value 2k2  [RES_0402_SMD]  (hidden comment: RMCF0402JT2K20)
R164  value 2k2  [RES_0402_SMD]  (hidden comment: RMCF0402JT2K20)
R165  value 2k2  [RES_0402_SMD]  (hidden comment: RMCF0402JT2K20)
R166  value 2k2  [RES_0402_SMD]  (hidden comment: RMCF0402JT2K20)
R167  value 2k2  [RES_0402_SMD]  (hidden comment: RMCF0402JT2K20)
U1  TCA9548APWR  [24-TSSOP]  (value not drawn)
U2  TCA9548APWR  [24-TSSOP]  (value not drawn)
U3  TCA9548APWR  [24-TSSOP]  (value not drawn)
U4  TCA9548APWR  [24-TSSOP]  (value not drawn)

### Blocks framed on the sheet
FIRST I2C SWITCH: C1 R160 R161 U1
ADDRESS SELECTION: R109-R114
SECOND I2C SWITCH: C2 R162 R163 U2
ADDRESS SELECTION: R115-R120
THIRD I2C SWITCH: C3 R164 R165 U3
ADDRESS SELECTION: R121-R126
FOURTH I2C SWITCH: C4 R166 R167 U4
ADDRESS SELECTION: R127-R132

### Ports
I2C_RESET-1, I2C_RESET-2, I2C_RESET-3, I2C_RESET-4, I2C_SCL-1, I2C_SCL-2, I2C_SCL-3, I2C_SCL-4, I2C_SDA-1, I2C_SDA-2, I2C_SDA-3, I2C_SDA-4, SCL_CH-1, SCL_CH-2, SCL_CH-3, SCL_CH-4, SCL_CH-5, SCL_CH-6, SCL_CH-7, SCL_CH-8, SCL_CH-9, SCL_CH-10, SCL_CH-11, SCL_CH-12, SCL_CH-13, SCL_CH-14, SCL_CH-15, SCL_CH-16, SCL_CH-17, SCL_CH-18, SCL_CH-19, SCL_CH-20, SCL_CH-21, SCL_CH-22, SCL_CH-23, SCL_CH-24, SCL_CH-25, SCL_CH-26, SCL_CH-27, SDA_CH-1, SDA_CH-2, SDA_CH-3, SDA_CH-4, SDA_CH-5, SDA_CH-6, SDA_CH-7, SDA_CH-8, SDA_CH-9, SDA_CH-10, SDA_CH-11, SDA_CH-12, SDA_CH-13, SDA_CH-14, SDA_CH-15, SDA_CH-16, SDA_CH-17, SDA_CH-18, SDA_CH-19, SDA_CH-20, SDA_CH-21, SDA_CH-22, SDA_CH-23, SDA_CH-24, SDA_CH-25, SDA_CH-26, SDA_CH-27

### Nets
3V3_INT: C1.2 C2.2 C3.2 C4.2 R109.2 R111.2 R113.2 R115.2 R116.2 R118.2 R121.2 R122.2 R124.2 R127.2 R128.2 R129.2 R160.2 R161.2 R162.2 R163.2 R164.2 R165.2 R166.2 R167.2 U1.24(VCC) U2.24(VCC) U3.24(VCC) U4.24(VCC)
GND: C1.1 C2.1 C3.1 C4.1 R110.2 R112.2 R114.2 R117.2 R119.2 R120.2 R123.2 R125.2 R126.2 R130.2 R131.2 R132.2 U1.12(GND) U2.12(GND) U3.12(GND) U4.12(GND)
I2C_SCL-1: R161.1 U1.22(SCL) ; port I2C_SCL-1
I2C_SCL-2: R163.1 U2.22(SCL) ; port I2C_SCL-2
I2C_SCL-3: R165.1 U3.22(SCL) ; port I2C_SCL-3
I2C_SCL-4: R166.1 U4.22(SCL) ; port I2C_SCL-4
I2C_SDA-1: R160.1 U1.23(SDA) ; port I2C_SDA-1
I2C_SDA-2: R162.1 U2.23(SDA) ; port I2C_SDA-2
I2C_SDA-3: R164.1 U3.23(SDA) ; port I2C_SDA-3
I2C_SDA-4: R167.1 U4.23(SDA) ; port I2C_SDA-4
TCA1_A0: R109.1 R110.1 U1.1(A0)
TCA1_A1: R111.1 R112.1 U1.2(A1)
TCA1_A2: R113.1 R114.1 U1.21(A2)
TCA2_A0: R115.1 R120.1 U2.1(A0)
TCA2_A1: R116.1 R117.1 U2.2(A1)
TCA2_A2: R118.1 R119.1 U2.21(A2)
TCA3_A0: R122.1 R123.1 U3.1(A0)
TCA3_A1: R121.1 R126.1 U3.2(A1)
TCA3_A2: R124.1 R125.1 U3.21(A2)
TCA4_A0: R127.1 R131.1 U4.1(A0)
TCA4_A1: R128.1 R132.1 U4.2(A1)
TCA4_A2: R129.1 R130.1 U4.21(A2)
NetR1_2: U1.4(SD0) ; port SDA_CH-1
NetR2_2: U1.6(SD1) ; port SDA_CH-2
NetR3_2: U1.8(SD2) ; port SDA_CH-3
NetR4_2: U1.5(SC0) ; port SCL_CH-1
NetR6_2: U1.7(SC1) ; port SCL_CH-2
NetR8_2: U1.9(SC2) ; port SCL_CH-3
NetR13_2: U1.10(SD3) ; port SDA_CH-4
NetR14_2: U1.13(SD4) ; port SDA_CH-5
NetR15_2: U1.15(SD5) ; port SDA_CH-6
NetR16_2: U1.11(SC3) ; port SCL_CH-4
NetR18_2: U1.14(SC4) ; port SCL_CH-5
NetR20_2: U1.16(SC5) ; port SCL_CH-6
NetR25_2: U1.17(SD6) ; port SDA_CH-7
NetR26_2: U1.19(SD7) ; port SDA_CH-8
NetR27_2: U2.4(SD0) ; port SDA_CH-9
NetR28_2: U1.18(SC6) ; port SCL_CH-7
NetR30_2: U1.20(SC7) ; port SCL_CH-8
NetR32_2: U2.5(SC0) ; port SCL_CH-9
NetR37_2: U2.6(SD1) ; port SDA_CH-10
NetR38_2: U2.8(SD2) ; port SDA_CH-11
NetR39_2: U2.10(SD3) ; port SDA_CH-12
NetR40_2: U2.7(SC1) ; port SCL_CH-10
NetR42_2: U2.9(SC2) ; port SCL_CH-11
NetR44_2: U2.11(SC3) ; port SCL_CH-12
NetR49_2: U2.13(SD4) ; port SDA_CH-13
NetR50_2: U2.15(SD5) ; port SDA_CH-14
NetR51_2: U2.17(SD6) ; port SDA_CH-15
NetR52_2: U2.14(SC4) ; port SCL_CH-13
NetR54_2: U2.16(SC5) ; port SCL_CH-14
NetR56_2: U2.18(SC6) ; port SCL_CH-15
NetR61_2: U2.19(SD7) ; port SDA_CH-16
NetR62_2: U3.4(SD0) ; port SDA_CH-17
NetR63_2: U3.6(SD1) ; port SDA_CH-18
NetR64_2: U2.20(SC7) ; port SCL_CH-16
NetR66_2: U3.5(SC0) ; port SCL_CH-17
NetR68_2: U3.7(SC1) ; port SCL_CH-18
NetR73_2: U3.8(SD2) ; port SDA_CH-19
NetR74_2: U3.10(SD3) ; port SDA_CH-20
NetR75_2: U3.13(SD4) ; port SDA_CH-21
NetR76_2: U3.9(SC2) ; port SCL_CH-19
NetR78_2: U3.11(SC3) ; port SCL_CH-20
NetR80_2: U3.14(SC4) ; port SCL_CH-21
NetR85_2: U3.15(SD5) ; port SDA_CH-22
NetR86_2: U3.17(SD6) ; port SDA_CH-23
NetR87_2: U3.19(SD7) ; port SDA_CH-24
NetR88_2: U3.16(SC5) ; port SCL_CH-22
NetR90_2: U3.18(SC6) ; port SCL_CH-23
NetR92_2: U3.20(SC7) ; port SCL_CH-24
NetR97_2: U4.4(SD0) ; port SDA_CH-25
NetR98_2: U4.6(SD1) ; port SDA_CH-26
NetR99_2: U4.8(SD2) ; port SDA_CH-27
NetR100_2: U4.5(SC0) ; port SCL_CH-25
NetR102_2: U4.7(SC1) ; port SCL_CH-26
NetR104_2: U4.9(SC2) ; port SCL_CH-27
NetU1_3: U1.3(~{RESET}) ; port I2C_RESET-1
NetU2_3: U2.3(~{RESET}) ; port I2C_RESET-2
NetU3_3: U3.3(~{RESET}) ; port I2C_RESET-3
NetU4_3: U4.3(~{RESET}) ; port I2C_RESET-4

Not connected (* = marked no-connect by the designer): U4 10(SD3)* 11(SC3)* 13(SD4)* 14(SC4)* 15(SD5)* 16(SC5)* 17(SD6)* 18(SC6)* 19(SD7)* 20(SC7)*

### Library data of the parts
C1-C4 = CAP_GEN_CER: 100nF 0402 Ceramic Capacitor; Voltage: 10V; Place: POP; Part Number: CL05B104KP5NNNC; Power: *; Package: *; Tolerance: *; Operating Temp.: *
R109 R111 R113 R116 R118 R120 R122 R124 R126 R129 R131 R132 = RES_GEN_SMD: Generic Chip Res 2k2; Tolerance: 5 %; Package: *; Part Number: RMCF0402JT2K20; Power: *; Voltage: *; Operating Temp.: *
R110 R112 R114 R115 R117 R119 R121 R123 R125 R127 R128 R130 R160-R167 = RES_GEN_SMD: as R133 on sheet MICROCONTROLLER; Package: *; Part Number: RMCF0402JT2K20; Power: *; Voltage: *; Operating Temp.: *
U1-U4 = TCA9548APWR: IC BUS SWITCH 1 X 8:1 24TSSOP; Manufacturer: Texas Instruments; Place: P; Part Number: TCA9548APWR; Operating Temp.: -40°C ~ 85°C; Power: N/A; Tolerance: N/A; Value: N/A; Voltage: N/A; Package: 24-TSSOP

## Sheet RGB LEDs.SchDoc
size A4
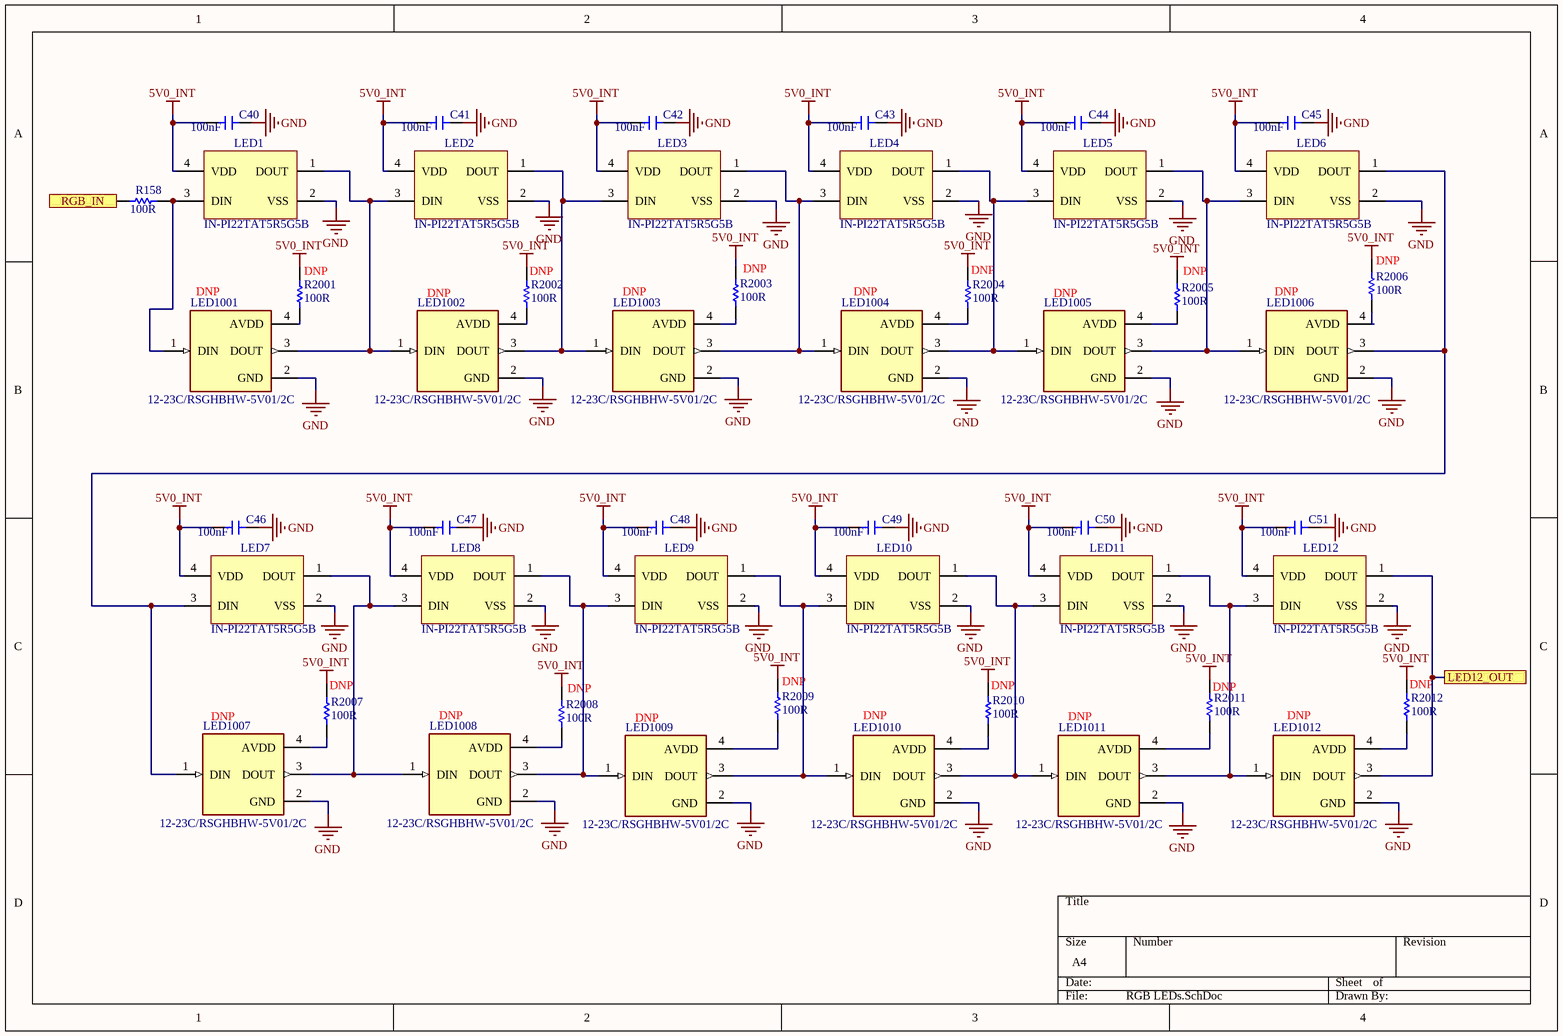
[diagram p4: RGB LEDs.SchDoc]

### Parts
C40  value 100nF  [CAP_0402_CER]  (hidden comment: CL05B104KP5NNNC)
C41  value 100nF  [CAP_0402_CER]  (hidden comment: CL05B104KP5NNNC)
C42  value 100nF  [CAP_0402_CER]  (hidden comment: CL05B104KP5NNNC)
C43  value 100nF  [CAP_0402_CER]  (hidden comment: CL05B104KP5NNNC)
C44  value 100nF  [CAP_0402_CER]  (hidden comment: CL05B104KP5NNNC)
C45  value 100nF  [CAP_0402_CER]  (hidden comment: CL05B104KP5NNNC)
C46  value 100nF  [CAP_0402_CER]  (hidden comment: CL05B104KP5NNNC)
C47  value 100nF  [CAP_0402_CER]  (hidden comment: CL05B104KP5NNNC)
C48  value 100nF  [CAP_0402_CER]  (hidden comment: CL05B104KP5NNNC)
C49  value 100nF  [CAP_0402_CER]  (hidden comment: CL05B104KP5NNNC)
C50  value 100nF  [CAP_0402_CER]  (hidden comment: CL05B104KP5NNNC)
C51  value 100nF  [CAP_0402_CER]  (hidden comment: CL05B104KP5NNNC)
LED1  IN-PI22TAT5R5G5B  [RGB_IN-PI22TAT5R5G5B]
LED2  IN-PI22TAT5R5G5B  [RGB_IN-PI22TAT5R5G5B]
LED3  IN-PI22TAT5R5G5B  [RGB_IN-PI22TAT5R5G5B]
LED4  IN-PI22TAT5R5G5B  [RGB_IN-PI22TAT5R5G5B]
LED5  IN-PI22TAT5R5G5B  [RGB_IN-PI22TAT5R5G5B]
LED6  IN-PI22TAT5R5G5B  [RGB_IN-PI22TAT5R5G5B]
LED7  IN-PI22TAT5R5G5B  [RGB_IN-PI22TAT5R5G5B]
LED8  IN-PI22TAT5R5G5B  [RGB_IN-PI22TAT5R5G5B]
LED9  IN-PI22TAT5R5G5B  [RGB_IN-PI22TAT5R5G5B]
LED10  IN-PI22TAT5R5G5B  [RGB_IN-PI22TAT5R5G5B]
LED11  IN-PI22TAT5R5G5B  [RGB_IN-PI22TAT5R5G5B]
LED12  IN-PI22TAT5R5G5B  [RGB_IN-PI22TAT5R5G5B]
LED1001  12-23C/RSGHBHW-5V01/2C  Place: DNP  [LED_12-23C/RSGHBHW-5V01/2C]  (no BOM)
LED1002  12-23C/RSGHBHW-5V01/2C  Place: DNP  [LED_12-23C/RSGHBHW-5V01/2C]  (no BOM)
LED1003  12-23C/RSGHBHW-5V01/2C  Place: DNP  [LED_12-23C/RSGHBHW-5V01/2C]  (no BOM)
LED1004  12-23C/RSGHBHW-5V01/2C  Place: DNP  [LED_12-23C/RSGHBHW-5V01/2C]  (no BOM)
LED1005  12-23C/RSGHBHW-5V01/2C  Place: DNP  [LED_12-23C/RSGHBHW-5V01/2C]  (no BOM)
LED1006  12-23C/RSGHBHW-5V01/2C  Place: DNP  [LED_12-23C/RSGHBHW-5V01/2C]  (no BOM)
LED1007  12-23C/RSGHBHW-5V01/2C  Place: DNP  [LED_12-23C/RSGHBHW-5V01/2C]  (no BOM)
LED1008  12-23C/RSGHBHW-5V01/2C  Place: DNP  [LED_12-23C/RSGHBHW-5V01/2C]  (no BOM)
LED1009  12-23C/RSGHBHW-5V01/2C  Place: DNP  [LED_12-23C/RSGHBHW-5V01/2C]  (no BOM)
LED1010  12-23C/RSGHBHW-5V01/2C  Place: DNP  [LED_12-23C/RSGHBHW-5V01/2C]  (no BOM)
LED1011  12-23C/RSGHBHW-5V01/2C  Place: DNP  [LED_12-23C/RSGHBHW-5V01/2C]  (no BOM)
LED1012  12-23C/RSGHBHW-5V01/2C  Place: DNP  [LED_12-23C/RSGHBHW-5V01/2C]  (no BOM)
R158  value 100R  [RES_0402_SMD]  (hidden comment: RMCF0402JT100R)
R2001  value 100R  Place: DNP  [RES_0402_SMD]  (hidden comment: RMCF0402JT100R)  (no BOM)
R2002  value 100R  Place: DNP  [RES_0402_SMD]  (hidden comment: RMCF0402JT100R)  (no BOM)
R2003  value 100R  Place: DNP  [RES_0402_SMD]  (hidden comment: RMCF0402JT100R)  (no BOM)
R2004  value 100R  Place: DNP  [RES_0402_SMD]  (hidden comment: RMCF0402JT100R)  (no BOM)
R2005  value 100R  Place: DNP  [RES_0402_SMD]  (hidden comment: RMCF0402JT100R)  (no BOM)
R2006  value 100R  Place: DNP  [RES_0402_SMD]  (hidden comment: RMCF0402JT100R)  (no BOM)
R2007  value 100R  Place: DNP  [RES_0402_SMD]  (hidden comment: RMCF0402JT100R)  (no BOM)
R2008  value 100R  Place: DNP  [RES_0402_SMD]  (hidden comment: RMCF0402JT100R)  (no BOM)
R2009  value 100R  Place: DNP  [RES_0402_SMD]  (hidden comment: RMCF0402JT100R)  (no BOM)
R2010  value 100R  Place: DNP  [RES_0402_SMD]  (hidden comment: RMCF0402JT100R)  (no BOM)
R2011  value 100R  Place: DNP  [RES_0402_SMD]  (hidden comment: RMCF0402JT100R)  (no BOM)
R2012  value 100R  Place: DNP  [RES_0402_SMD]  (hidden comment: RMCF0402JT100R)  (no BOM)

### Ports
LED12_OUT, RGB_IN

### Nets
5V0_INT: C40.2 C41.2 C42.2 C43.2 C44.2 C45.2 C46.2 C47.2 C48.2 C49.2 C50.2 C51.2 LED1.4(VDD) LED2.4(VDD) LED3.4(VDD) LED4.4(VDD) LED5.4(VDD) LED6.4(VDD) LED7.4(VDD) LED8.4(VDD) LED9.4(VDD) LED10.4(VDD) LED11.4(VDD) LED12.4(VDD) R2001.2 R2002.2 R2003.2 R2004.1 R2005.1 R2006.1 R2007.1 R2008.1 R2009.1 R2010.1 R2011.1 R2012.1
GND: C40.1 C41.1 C42.1 C43.1 C44.1 C45.1 C46.1 C47.1 C48.1 C49.1 C50.1 C51.1 LED1.2(VSS) LED2.2(VSS) LED3.2(VSS) LED4.2(VSS) LED5.2(VSS) LED6.2(VSS) LED7.2(VSS) LED8.2(VSS) LED9.2(VSS) LED10.2(VSS) LED11.2(VSS) LED12.2(VSS) LED1001.2(GND) LED1002.2(GND) LED1003.2(GND) LED1004.2(GND) LED1005.2(GND) LED1006.2(GND) LED1007.2(GND) LED1008.2(GND) LED1009.2(GND) LED1010.2(GND) LED1011.2(GND) LED1012.2(GND)
NetLED1_1: LED1.1(DOUT) LED2.3(DIN) LED1001.3(DOUT) LED1002.1(DIN)
NetLED1_3: LED1.3(DIN) LED1001.1(DIN) R158.1
NetLED2_1: LED2.1(DOUT) LED3.3(DIN) LED1002.3(DOUT) LED1003.1(DIN)
NetLED3_1: LED3.1(DOUT) LED4.3(DIN) LED1003.3(DOUT) LED1004.1(DIN)
NetLED4_1: LED4.1(DOUT) LED5.3(DIN) LED1004.3(DOUT) LED1005.1(DIN)
NetLED5_1: LED5.1(DOUT) LED6.3(DIN) LED1005.3(DOUT) LED1006.1(DIN)
NetLED6_1: LED6.1(DOUT) LED7.3(DIN) LED1006.3(DOUT) LED1007.1(DIN)
NetLED7_1: LED7.1(DOUT) LED8.3(DIN) LED1007.3(DOUT) LED1008.1(DIN)
NetLED8_1: LED8.1(DOUT) LED9.3(DIN) LED1008.3(DOUT) LED1009.1(DIN)
NetLED9_1: LED9.1(DOUT) LED10.3(DIN) LED1009.3(DOUT) LED1010.1(DIN)
NetLED10_1: LED10.1(DOUT) LED11.3(DIN) LED1010.3(DOUT) LED1011.1(DIN)
NetLED11_1: LED11.1(DOUT) LED12.3(DIN) LED1011.3(DOUT) LED1012.1(DIN)
NetLED12_1: LED12.1(DOUT) LED1012.3(DOUT) ; port LED12_OUT
NetLED1001_4: LED1001.4(AVDD) R2001.1
NetLED1002_4: LED1002.4(AVDD) R2002.1
NetLED1003_4: LED1003.4(AVDD) R2003.1
NetLED1004_4: LED1004.4(AVDD) R2004.2
NetLED1005_4: LED1005.4(AVDD) R2005.2
NetLED1006_4: LED1006.4(AVDD) R2006.2
NetLED1007_4: LED1007.4(AVDD) R2007.2
NetLED1008_4: LED1008.4(AVDD) R2008.2
NetLED1009_4: LED1009.4(AVDD) R2009.2
NetLED1010_4: LED1010.4(AVDD) R2010.2
NetLED1011_4: LED1011.4(AVDD) R2011.2
NetLED1012_4: LED1012.4(AVDD) R2012.2
NetR158_2: R158.2 ; port RGB_IN

### Library data of the parts
C40-C51 = CAP_GEN_CER: as C1 on sheet I2C SWITCH; Part Number: CL05B104KP5NNNC; Power: *; Package: *; Tolerance: *; Operating Temp.: *
LED1-LED12 = IN-PI22TAT5R5G5B: ADDRESS LED DISCRETE SERIAL RGB; Manufacturer: Inolux; Place: P; Part Number: IN-PI22TAT5R5G5B; Operating Temp.: -40°C ~ 85°C; Power: N/A; Tolerance: N/A; Value: N/A; Voltage: N/A; Package: IN-PI22TAT5R5G5B
LED1001-LED1012 = 12-23C/RSGHBHW-5V01/2C: Addressable Lighting series 1 LED Discrete Serial (Shift Register) Red, Green, Blue (RGB) 3.00mm L x 1.00mm W; MF: Everlight Electronics Co Ltd; Package: SMD-4 Everlight Electronics Co Ltd; SnapEDA_Link: https://www.snapeda.com/parts/12-23C/RSGHBHW-5V01/2C/Everlight+Electronics+Co+Ltd/view-part/?ref=snap; MP: 12-23C/RSGHBHW-5V01/2C; Purchase-URL: https://pricing.snapeda.com/search/part/12-23C/RSGHBHW-5V01/2C/?ref=eda; Value: *; Availability: In Stock; Price: None; Check_prices: https://www.snapeda.com/parts/12-23C/RSGHBHW-5V01/2C/Everlight+Electronics+Co+Ltd/view-part/?ref=eda; Part Number: 12-23C/RSGHBHW-5V01/2C
R158 = RES_GEN_SMD: Generic Chip Res 100R; Tolerance: 5 %; Place: POP; Package: *; Part Number: RMCF0402JT100R; Power: *; Voltage: *; Operating Temp.: *
R2001-R2012 = RES_GEN_SMD: Generic Chip Res 100R; Tolerance: 5 %; Package: *; Part Number: RMCF0402JT100R; Power: *; Voltage: *; Operating Temp.: *

## Sheet RGB_LED_2.SchDoc
size A4
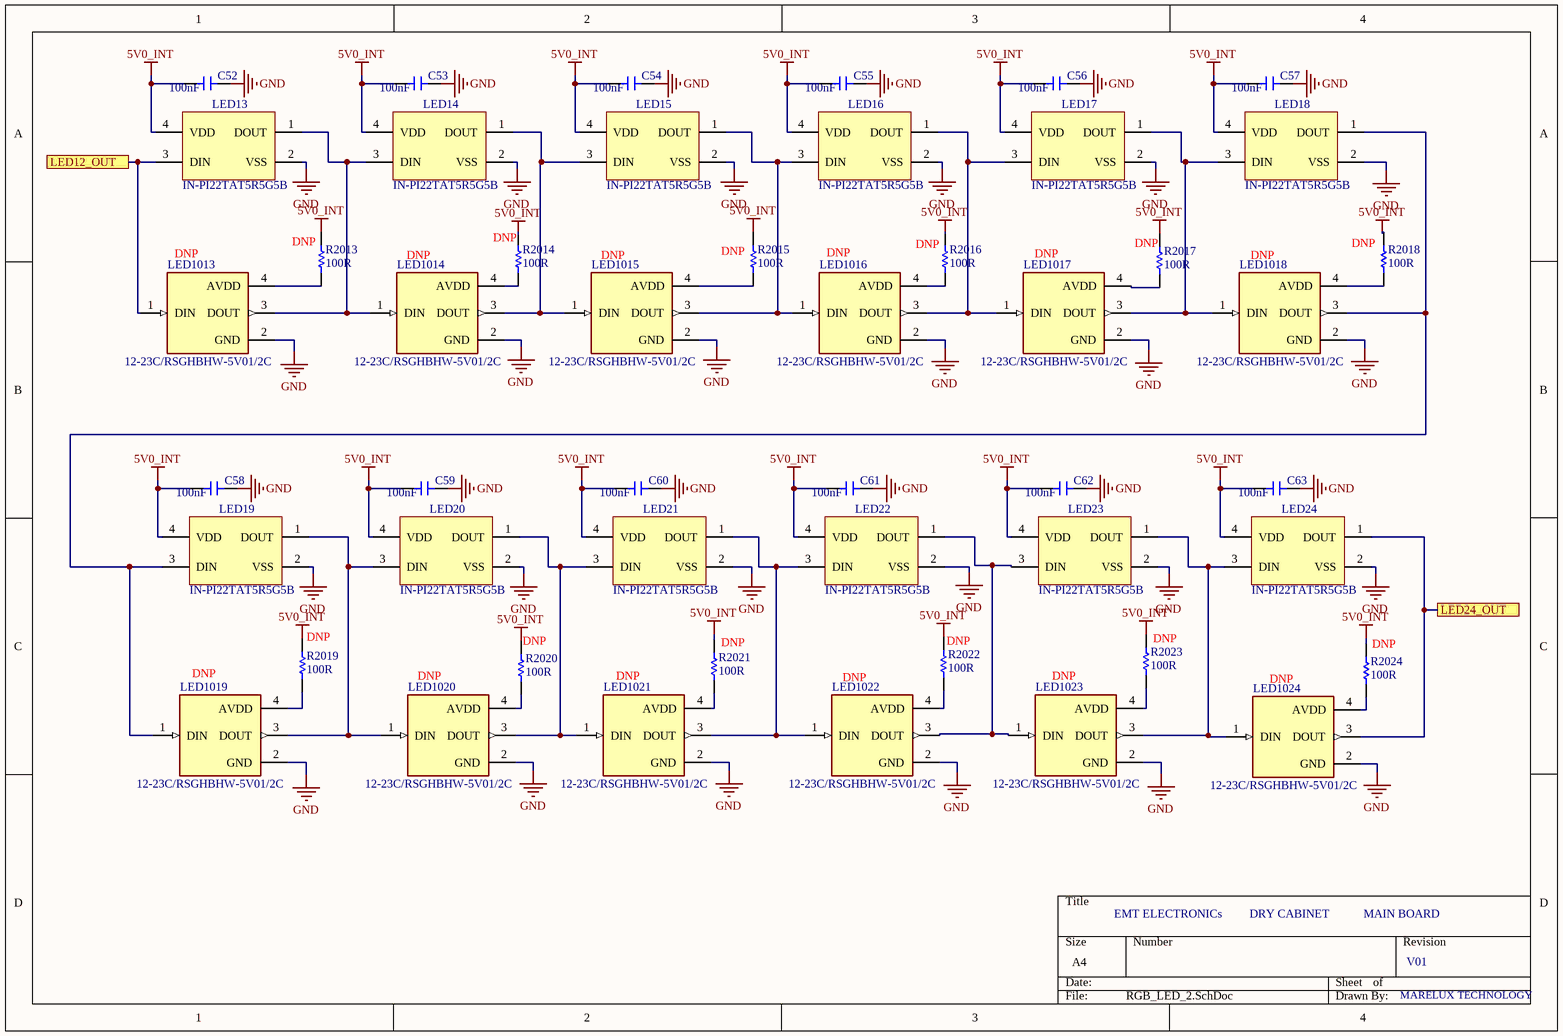
[diagram p5: RGB_LED_2.SchDoc]

### Parts
C52  value 100nF  [CAP_0402_CER]  (hidden comment: CL05B104KP5NNNC)
C53  value 100nF  [CAP_0402_CER]  (hidden comment: CL05B104KP5NNNC)
C54  value 100nF  [CAP_0402_CER]  (hidden comment: CL05B104KP5NNNC)
C55  value 100nF  [CAP_0402_CER]  (hidden comment: CL05B104KP5NNNC)
C56  value 100nF  [CAP_0402_CER]  (hidden comment: CL05B104KP5NNNC)
C57  value 100nF  [CAP_0402_CER]  (hidden comment: CL05B104KP5NNNC)
C58  value 100nF  [CAP_0402_CER]  (hidden comment: CL05B104KP5NNNC)
C59  value 100nF  [CAP_0402_CER]  (hidden comment: CL05B104KP5NNNC)
C60  value 100nF  [CAP_0402_CER]  (hidden comment: CL05B104KP5NNNC)
C61  value 100nF  [CAP_0402_CER]  (hidden comment: CL05B104KP5NNNC)
C62  value 100nF  [CAP_0402_CER]  (hidden comment: CL05B104KP5NNNC)
C63  value 100nF  [CAP_0402_CER]  (hidden comment: CL05B104KP5NNNC)
LED13  IN-PI22TAT5R5G5B  [RGB_IN-PI22TAT5R5G5B]
LED14  IN-PI22TAT5R5G5B  [RGB_IN-PI22TAT5R5G5B]
LED15  IN-PI22TAT5R5G5B  [RGB_IN-PI22TAT5R5G5B]
LED16  IN-PI22TAT5R5G5B  [RGB_IN-PI22TAT5R5G5B]
LED17  IN-PI22TAT5R5G5B  [RGB_IN-PI22TAT5R5G5B]
LED18  IN-PI22TAT5R5G5B  [RGB_IN-PI22TAT5R5G5B]
LED19  IN-PI22TAT5R5G5B  [RGB_IN-PI22TAT5R5G5B]
LED20  IN-PI22TAT5R5G5B  [RGB_IN-PI22TAT5R5G5B]
LED21  IN-PI22TAT5R5G5B  [RGB_IN-PI22TAT5R5G5B]
LED22  IN-PI22TAT5R5G5B  [RGB_IN-PI22TAT5R5G5B]
LED23  IN-PI22TAT5R5G5B  [RGB_IN-PI22TAT5R5G5B]
LED24  IN-PI22TAT5R5G5B  [RGB_IN-PI22TAT5R5G5B]
LED1013  12-23C/RSGHBHW-5V01/2C  Place: DNP  [LED_12-23C/RSGHBHW-5V01/2C]  (no BOM)
LED1014  12-23C/RSGHBHW-5V01/2C  Place: DNP  [LED_12-23C/RSGHBHW-5V01/2C]  (no BOM)
LED1015  12-23C/RSGHBHW-5V01/2C  Place: DNP  [LED_12-23C/RSGHBHW-5V01/2C]  (no BOM)
LED1016  12-23C/RSGHBHW-5V01/2C  Place: DNP  [LED_12-23C/RSGHBHW-5V01/2C]  (no BOM)
LED1017  12-23C/RSGHBHW-5V01/2C  Place: DNP  [LED_12-23C/RSGHBHW-5V01/2C]  (no BOM)
LED1018  12-23C/RSGHBHW-5V01/2C  Place: DNP  [LED_12-23C/RSGHBHW-5V01/2C]  (no BOM)
LED1019  12-23C/RSGHBHW-5V01/2C  Place: DNP  [LED_12-23C/RSGHBHW-5V01/2C]  (no BOM)
LED1020  12-23C/RSGHBHW-5V01/2C  Place: DNP  [LED_12-23C/RSGHBHW-5V01/2C]  (no BOM)
LED1021  12-23C/RSGHBHW-5V01/2C  Place: DNP  [LED_12-23C/RSGHBHW-5V01/2C]  (no BOM)
LED1022  12-23C/RSGHBHW-5V01/2C  Place: DNP  [LED_12-23C/RSGHBHW-5V01/2C]  (no BOM)
LED1023  12-23C/RSGHBHW-5V01/2C  Place: DNP  [LED_12-23C/RSGHBHW-5V01/2C]  (no BOM)
LED1024  12-23C/RSGHBHW-5V01/2C  Place: DNP  [LED_12-23C/RSGHBHW-5V01/2C]  (no BOM)
R2013  value 100R  Place: DNP  [RES_0402_SMD]  (hidden comment: RMCF0402JT100R)  (no BOM)
R2014  value 100R  Place: DNP  [RES_0402_SMD]  (hidden comment: RMCF0402JT100R)  (no BOM)
R2015  value 100R  Place: DNP  [RES_0402_SMD]  (hidden comment: RMCF0402JT100R)  (no BOM)
R2016  value 100R  Place: DNP  [RES_0402_SMD]  (hidden comment: RMCF0402JT100R)  (no BOM)
R2017  value 100R  Place: DNP  [RES_0402_SMD]  (hidden comment: RMCF0402JT100R)  (no BOM)
R2018  value 100R  Place: DNP  [RES_0402_SMD]  (hidden comment: RMCF0402JT100R)  (no BOM)
R2019  value 100R  Place: DNP  [RES_0402_SMD]  (hidden comment: RMCF0402JT100R)  (no BOM)
R2020  value 100R  Place: DNP  [RES_0402_SMD]  (hidden comment: RMCF0402JT100R)  (no BOM)
R2021  value 100R  Place: DNP  [RES_0402_SMD]  (hidden comment: RMCF0402JT100R)  (no BOM)
R2022  value 100R  Place: DNP  [RES_0402_SMD]  (hidden comment: RMCF0402JT100R)  (no BOM)
R2023  value 100R  Place: DNP  [RES_0402_SMD]  (hidden comment: RMCF0402JT100R)  (no BOM)
R2024  value 100R  Place: DNP  [RES_0402_SMD]  (hidden comment: RMCF0402JT100R)  (no BOM)

### Ports
LED12_OUT, LED24_OUT

### Nets
5V0_INT: C52.2 C53.2 C54.2 C55.2 C56.2 C57.2 C58.2 C59.2 C60.2 C61.2 C62.2 C63.2 LED13.4(VDD) LED14.4(VDD) LED15.4(VDD) LED16.4(VDD) LED17.4(VDD) LED18.4(VDD) LED19.4(VDD) LED20.4(VDD) LED21.4(VDD) LED22.4(VDD) LED23.4(VDD) LED24.4(VDD) R2013.1 R2014.1 R2015.1 R2016.1 R2017.1 R2018.1 R2019.1 R2020.1 R2021.1 R2022.1 R2023.1 R2024.1
GND: C52.1 C53.1 C54.1 C55.1 C56.1 C57.1 C58.1 C59.1 C60.1 C61.1 C62.1 C63.1 LED13.2(VSS) LED14.2(VSS) LED15.2(VSS) LED16.2(VSS) LED17.2(VSS) LED18.2(VSS) LED19.2(VSS) LED20.2(VSS) LED21.2(VSS) LED22.2(VSS) LED23.2(VSS) LED24.2(VSS) LED1013.2(GND) LED1014.2(GND) LED1015.2(GND) LED1016.2(GND) LED1017.2(GND) LED1018.2(GND) LED1019.2(GND) LED1020.2(GND) LED1021.2(GND) LED1022.2(GND) LED1023.2(GND) LED1024.2(GND)
NetLED12_1: LED13.3(DIN) LED1013.1(DIN) ; port LED12_OUT
NetLED13_1: LED13.1(DOUT) LED14.3(DIN) LED1013.3(DOUT) LED1014.1(DIN)
NetLED14_1: LED14.1(DOUT) LED15.3(DIN) LED1014.3(DOUT) LED1015.1(DIN)
NetLED15_1: LED15.1(DOUT) LED16.3(DIN) LED1015.3(DOUT) LED1016.1(DIN)
NetLED16_1: LED16.1(DOUT) LED17.3(DIN) LED1016.3(DOUT) LED1017.1(DIN)
NetLED17_1: LED17.1(DOUT) LED18.3(DIN) LED1017.3(DOUT) LED1018.1(DIN)
NetLED18_1: LED18.1(DOUT) LED19.3(DIN) LED1018.3(DOUT) LED1019.1(DIN)
NetLED19_1: LED19.1(DOUT) LED20.3(DIN) LED1019.3(DOUT) LED1020.1(DIN)
NetLED20_1: LED20.1(DOUT) LED21.3(DIN) LED1020.3(DOUT) LED1021.1(DIN)
NetLED21_1: LED21.1(DOUT) LED22.3(DIN) LED1021.3(DOUT) LED1022.1(DIN)
NetLED22_1: LED22.1(DOUT) LED23.3(DIN) LED1022.3(DOUT) LED1023.1(DIN)
NetLED23_1: LED23.1(DOUT) LED24.3(DIN) LED1023.3(DOUT) LED1024.1(DIN)
NetLED24_1: LED24.1(DOUT) LED1024.3(DOUT) ; port LED24_OUT
NetLED1013_4: LED1013.4(AVDD) R2013.2
NetLED1014_4: LED1014.4(AVDD) R2014.2
NetLED1015_4: LED1015.4(AVDD) R2015.2
NetLED1016_4: LED1016.4(AVDD) R2016.2
NetLED1017_4: LED1017.4(AVDD) R2017.2
NetLED1018_4: LED1018.4(AVDD) R2018.2
NetLED1019_4: LED1019.4(AVDD) R2019.2
NetLED1020_4: LED1020.4(AVDD) R2020.2
NetLED1021_4: LED1021.4(AVDD) R2021.2
NetLED1022_4: LED1022.4(AVDD) R2022.2
NetLED1023_4: LED1023.4(AVDD) R2023.2
NetLED1024_4: LED1024.4(AVDD) R2024.2

### Library data of the parts
C52-C63 = CAP_GEN_CER: as C1 on sheet I2C SWITCH; Part Number: CL05B104KP5NNNC; Power: *; Package: *; Tolerance: *; Operating Temp.: *
LED13-LED24 = IN-PI22TAT5R5G5B: as LED1 on sheet RGB LEDs; Part Number: IN-PI22TAT5R5G5B; Operating Temp.: -40°C ~ 85°C; Power: N/A; Tolerance: N/A; Value: N/A; Voltage: N/A; Package: IN-PI22TAT5R5G5B
LED1013-LED1024 = 12-23C/RSGHBHW-5V01/2C: as LED1001 on sheet RGB LEDs; Package: SMD-4 Everlight Electronics Co Ltd; SnapEDA_Link: https://www.snapeda.com/parts/12-23C/RSGHBHW-5V01/2C/Everlight+Electronics+Co+Ltd/view-part/?ref=snap; MP: 12-23C/RSGHBHW-5V01/2C; Purchase-URL: https://pricing.snapeda.com/search/part/12-23C/RSGHBHW-5V01/2C/?ref=eda; Value: *; Availability: In Stock; Price: None; Check_prices: https://www.snapeda.com/parts/12-23C/RSGHBHW-5V01/2C/Everlight+Electronics+Co+Ltd/view-part/?ref=eda; Part Number: 12-23C/RSGHBHW-5V01/2C
R2013-R2024 = RES_GEN_SMD: Generic Chip Res 100R; Tolerance: 5 %; Package: *; Part Number: RMCF0402JT100R; Power: *; Voltage: *; Operating Temp.: *

## Sheet RGB_LED_3.SchDoc
size A4
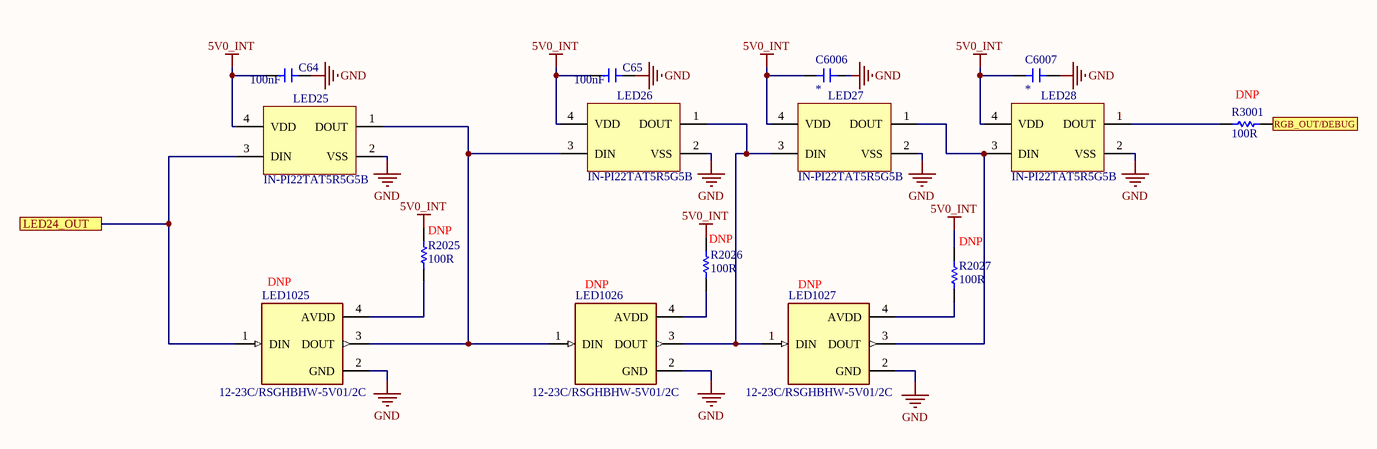
[diagram p6: RGB_LED_3.SchDoc]

### Parts
C64  value 100nF  [CAP_0402_CER]  (hidden comment: CL05B104KP5NNNC)
C65  value 100nF  [CAP_0402_CER]  (hidden comment: CL05B104KP5NNNC)
C6006  *  [CAP_0402_CER]
C6007  *  [CAP_0402_CER]
LED25  IN-PI22TAT5R5G5B  [RGB_IN-PI22TAT5R5G5B]
LED26  IN-PI22TAT5R5G5B  [RGB_IN-PI22TAT5R5G5B]
LED27  IN-PI22TAT5R5G5B  [RGB_IN-PI22TAT5R5G5B]
LED28  IN-PI22TAT5R5G5B  [RGB_IN-PI22TAT5R5G5B]
LED1025  12-23C/RSGHBHW-5V01/2C  Place: DNP  [LED_12-23C/RSGHBHW-5V01/2C]  (no BOM)
LED1026  12-23C/RSGHBHW-5V01/2C  Place: DNP  [LED_12-23C/RSGHBHW-5V01/2C]  (no BOM)
LED1027  12-23C/RSGHBHW-5V01/2C  Place: DNP  [LED_12-23C/RSGHBHW-5V01/2C]  (no BOM)
R2025  value 100R  Place: DNP  [RES_0402_SMD]  (hidden comment: RMCF0402JT100R)  (no BOM)
R2026  value 100R  Place: DNP  [RES_0402_SMD]  (hidden comment: RMCF0402JT100R)  (no BOM)
R2027  value 100R  Place: DNP  [RES_0402_SMD]  (hidden comment: RMCF0402JT100R)  (no BOM)
R3001  value 100R  Place: DNP  [RES_0402_SMD]  (hidden comment: RMCF0402JT100R)  (no BOM)

### Ports
LED24_OUT, RGB_OUT/DEBUG

### Nets
5V0_INT: C64.2 C65.2 C6006.1 C6007.1 LED25.4(VDD) LED26.4(VDD) LED27.4(VDD) LED28.4(VDD) R2025.1 R2026.1 R2027.1
GND: C64.1 C65.1 C6006.2 C6007.2 LED25.2(VSS) LED26.2(VSS) LED27.2(VSS) LED28.2(VSS) LED1025.2(GND) LED1026.2(GND) LED1027.2(GND)
NetLED24_1: LED25.3(DIN) LED1025.1(DIN) ; port LED24_OUT
NetLED25_1: LED25.1(DOUT) LED26.3(DIN) LED1025.3(DOUT) LED1026.1(DIN)
NetLED26_1: LED26.1(DOUT) LED27.3(DIN) LED1026.3(DOUT) LED1027.1(DIN)
NetLED27_1: LED27.1(DOUT) LED28.3(DIN) LED1027.3(DOUT)
NetLED28_1: LED28.1(DOUT) R3001.1
NetLED1025_4: LED1025.4(AVDD) R2025.2
NetLED1026_4: LED1026.4(AVDD) R2026.2
NetLED1027_4: LED1027.4(AVDD) R2027.2
NetR168_2: R3001.2 ; port RGB_OUT/DEBUG

### Library data of the parts
C64 C65 = CAP_GEN_CER: as C1 on sheet I2C SWITCH; Part Number: CL05B104KP5NNNC; Power: *; Package: *; Tolerance: *; Operating Temp.: *
C6006 C6007 = CAP_GEN_CER: Generic; Part Number: *; Power: *; Package: *; Tolerance: *; Value: *; Voltage: *; Place: *; Operating Temp.: *
LED25-LED28 = IN-PI22TAT5R5G5B: as LED1 on sheet RGB LEDs; Part Number: IN-PI22TAT5R5G5B; Operating Temp.: -40°C ~ 85°C; Power: N/A; Tolerance: N/A; Value: N/A; Voltage: N/A; Package: IN-PI22TAT5R5G5B
LED1025-LED1027 = 12-23C/RSGHBHW-5V01/2C: as LED1001 on sheet RGB LEDs; Package: SMD-4 Everlight Electronics Co Ltd; SnapEDA_Link: https://www.snapeda.com/parts/12-23C/RSGHBHW-5V01/2C/Everlight+Electronics+Co+Ltd/view-part/?ref=snap; MP: 12-23C/RSGHBHW-5V01/2C; Purchase-URL: https://pricing.snapeda.com/search/part/12-23C/RSGHBHW-5V01/2C/?ref=eda; Value: *; Availability: In Stock; Price: None; Check_prices: https://www.snapeda.com/parts/12-23C/RSGHBHW-5V01/2C/Everlight+Electronics+Co+Ltd/view-part/?ref=eda; Part Number: 12-23C/RSGHBHW-5V01/2C
R2025-R2027 R3001 = RES_GEN_SMD: Generic Chip Res 100R; Tolerance: 5 %; Package: *; Part Number: RMCF0402JT100R; Power: *; Voltage: *; Operating Temp.: *

## Sheet MISC.SchDoc
size A4
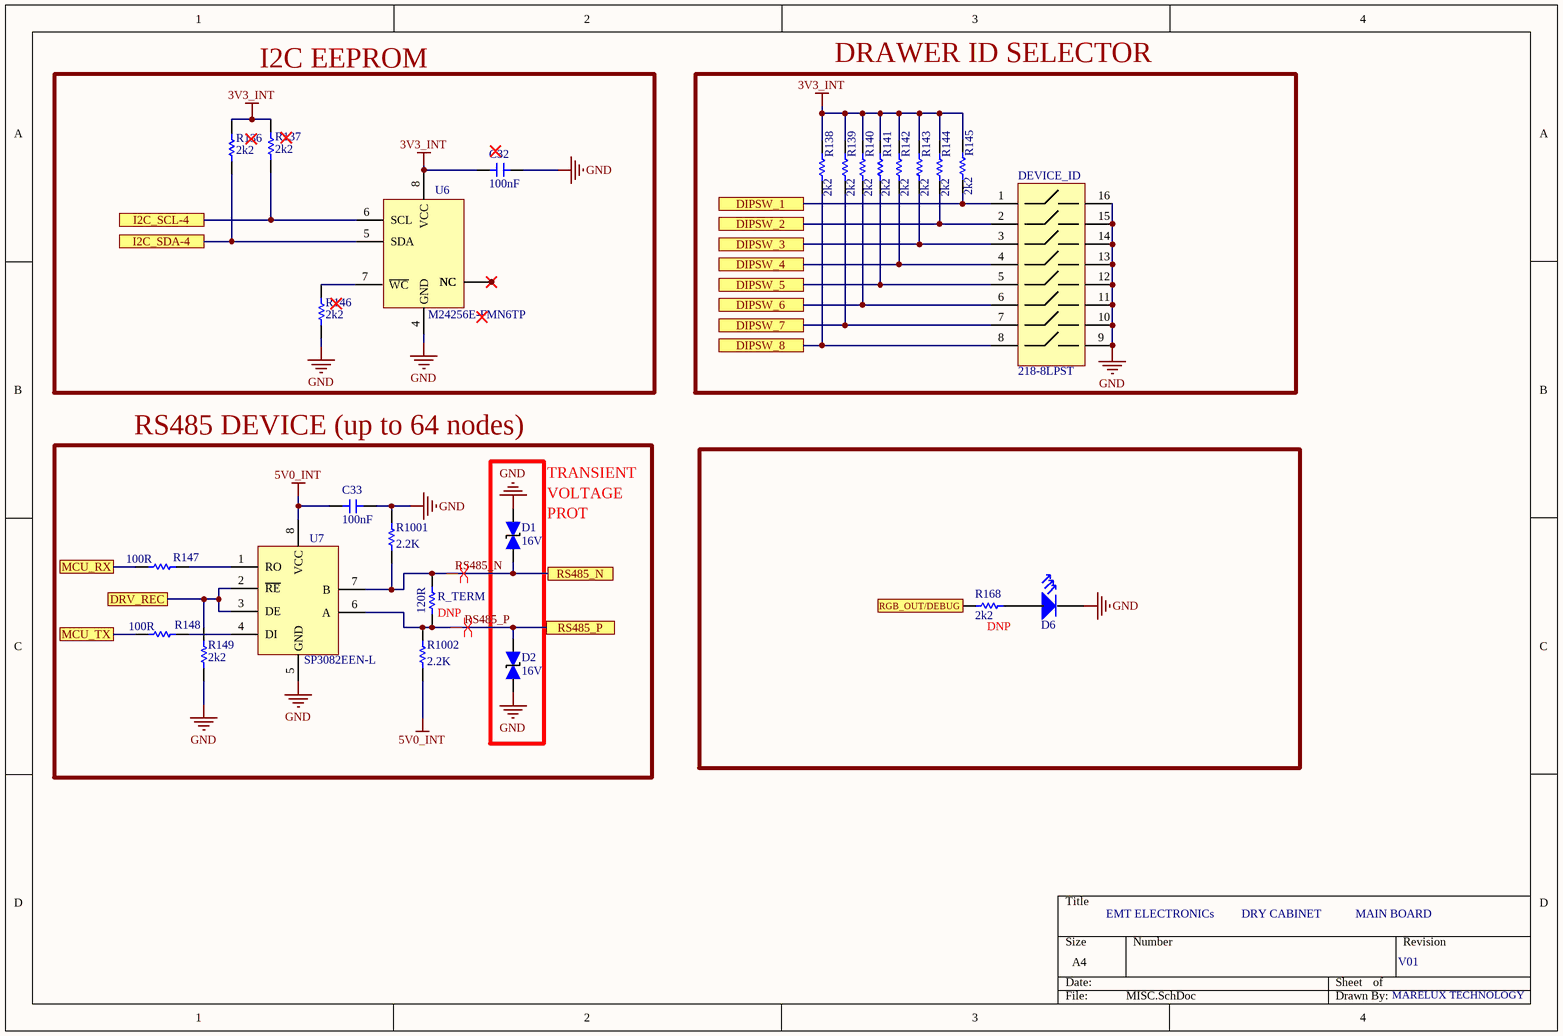
[diagram p7: MISC.SchDoc]

### Parts
C32  value 100nF  [CAP_0402_CER]  (hidden comment: CL05B104KP5NNNC)
C33  value 100nF  [CAP_0402_CER]  (hidden comment: CL05B104KP5NNNC)
D1  value 16V  [SOD-123F]  (hidden comment: SMF16CA)
D2  value 16V  [SOD-123F]  (hidden comment: SMF16CA)
D6  HSMM-C170  [LED_0805_SMD]  (value not drawn)
DEVICE_ID  218-8LPST  [218-8LPST]
R136  value 2k2  [RES_0402_SMD]  (hidden comment: RMCF0402JT2K20)
R137  value 2k2  [RES_0402_SMD]  (hidden comment: RMCF0402JT2K20)
R138  value 2k2  [RES_0402_SMD]  (hidden comment: RMCF0402JT2K20)
R139  value 2k2  [RES_0402_SMD]  (hidden comment: RMCF0402JT2K20)
R140  value 2k2  [RES_0402_SMD]  (hidden comment: RMCF0402JT2K20)
R141  value 2k2  [RES_0402_SMD]  (hidden comment: RMCF0402JT2K20)
R142  value 2k2  [RES_0402_SMD]  (hidden comment: RMCF0402JT2K20)
R143  value 2k2  [RES_0402_SMD]  (hidden comment: RMCF0402JT2K20)
R144  value 2k2  [RES_0402_SMD]  (hidden comment: RMCF0402JT2K20)
R145  value 2k2  [RES_0402_SMD]  (hidden comment: RMCF0402JT2K20)
R146  value 2k2  [RES_0402_SMD]  (hidden comment: RMCF0402JT2K20)
R147  value 100R  [RES_0402_SMD]  (hidden comment: RMCF0402JT100R)
R148  value 100R  [RES_0402_SMD]  (hidden comment: RMCF0402JT100R)
R149  value 2k2  [RES_0402_SMD]  (hidden comment: RMCF0402JT2K20)
R168  value 2k2  Place: DNP  [RES_0402_SMD]  (hidden comment: RMCF0402JT2K20)  (no BOM)
R1001  value 2.2K  [RES_0402_SMD]  (hidden comment: RMCF0402JT2K20)
R1002  value 2.2K  [RES_0402_SMD]  (hidden comment: RMCF0402JT2K20)
R_TERM  value 120R  Place: DNP  [RES_0805_SMD]  (hidden comment: ESR10EZPJ121)  (no BOM)
U6  M24256E-FMN6TP  [8-SOIC(0.154", 3.90mm Width)]
U7  SP3082EEN-L  [8-SOIC(0.154", 3.90mm Width)]

### Blocks framed on the sheet
I2C EEPROM: C32 R136 R137 R146 U6
DRAWER ID SELECTOR: DEVICE_ID R138-R145
RS485 DEVICE (up to 64 nodes): C33 D1 D2 R147-R149 R1001 R1002 R_TERM U7

### Ports
DIPSW_1, DIPSW_2, DIPSW_3, DIPSW_4, DIPSW_5, DIPSW_6, DIPSW_7, DIPSW_8, DRV_REC, I2C_SCL-4, I2C_SDA-4, MCU_RX, MCU_TX, RGB_OUT/DEBUG, RS485_N, RS485_P

### Nets
3V3_INT: C32.2 R136.2 R137.2 R138.1 R139.1 R140.1 R141.1 R142.1 R143.1 R144.1 R145.1 U6.8(VCC)
5V0_INT: C33.2 R1002.1 U7.8(VCC)
GND: C32.1 C33.1 D1.2(A) D2.2(A) D6.C DEVICE_ID.9 DEVICE_ID.10 DEVICE_ID.11 DEVICE_ID.12 DEVICE_ID.13 DEVICE_ID.14 DEVICE_ID.15 DEVICE_ID.16 R146.1 R149.1 R1001.2 U6.4(GND) U7.5(GND)
I2C_SCL-4: R137.1 U6.6(SCL) ; port I2C_SCL-4
I2C_SDA-4: R136.1 U6.5(SDA) ; port I2C_SDA-4
RS485_N: D1.1(C) R1001.1 R_TERM.1 U7.7(B) ; port RS485_N
RS485_P: D2.1(C) R1002.2 R_TERM.2 U7.6(A) ; port RS485_P
NetD6_A: D6.A R168.1
NetDEVICE_ID_1: DEVICE_ID.1 R145.2 ; port DIPSW_1
NetDEVICE_ID_2: DEVICE_ID.2 R144.2 ; port DIPSW_2
NetDEVICE_ID_3: DEVICE_ID.3 R143.2 ; port DIPSW_3
NetDEVICE_ID_4: DEVICE_ID.4 R142.2 ; port DIPSW_4
NetDEVICE_ID_5: DEVICE_ID.5 R141.2 ; port DIPSW_5
NetDEVICE_ID_6: DEVICE_ID.6 R140.2 ; port DIPSW_6
NetDEVICE_ID_7: DEVICE_ID.7 R139.2 ; port DIPSW_7
NetDEVICE_ID_8: DEVICE_ID.8 R138.2 ; port DIPSW_8
NetR146_2: R146.2 U6.7(~{WC})
NetR147_1: R147.1 U7.1(RO)
NetR147_2: R147.2 ; port MCU_RX
NetR148_1: R148.1 U7.4(DI)
NetR148_2: R148.2 ; port MCU_TX
NetR149_2: R149.2 U7.2(~{RE}) U7.3(DE) ; port DRV_REC
NetR168_2: R168.2 ; port RGB_OUT/DEBUG
NetU6_1: U6.1(NC) U6.2(NC) U6.3(NC)

### Layout directives
differential pair: RS485_N, RS485_P

### Notes on the sheet
- (near D1) TRANSIENT
- (near D1) VOLTAGE
- (near D1) PROT

### Library data of the parts
C32 C33 = CAP_GEN_CER: as C1 on sheet I2C SWITCH; Part Number: CL05B104KP5NNNC; Power: *; Package: *; Tolerance: *; Operating Temp.: *
D1 D2 = SMF16CA: Unidirectional TVS DIODE 200W 16V-17.8V SOD-123; Manufacturer: ANBON SEMI; Voltage: 17.8V; Place: POP; Part Number: SMF16CA; Power: 200W; Tolerance: N/A; Package: SOD-123F; Operating Temp.: -55°C ~ 150°C
D6 = LED_GEN: as D4 on sheet POWER; Part Number: HSMM-C170; Value: *; Power: *; Tolerance: *; Package: 0805; Operating Temp.: *
DEVICE_ID = 218-8LPST: Dip Switch SPST 8 Position Surface Mount Slide (Standard) Actuator 100mA 20VDC; Manufacturer: CST; Value: SPST-8POS; Place: POP; Tolerance: N/A; Voltage: N/A; Power: N/A; Part Number: 218-8LPST; Package: 218-8LPST; Operating Temp.: -40°C ~ 85°C
R136-R146 R149 = RES_GEN_SMD: as R133 on sheet MICROCONTROLLER; Package: *; Part Number: RMCF0402JT2K20; Power: *; Voltage: *; Operating Temp.: *
R147 R148 = RES_GEN_SMD: as R158 on sheet RGB LEDs; Package: *; Part Number: RMCF0402JT100R; Power: *; Voltage: *; Operating Temp.: *
R168 = RES_GEN_SMD: Generic Chip Res 2k2; Tolerance: 5 %; Package: *; Part Number: RMCF0402JT2K20; Power: *; Voltage: *; Operating Temp.: *
R1001 R1002 = RES_GEN_SMD: Generic Chip Res; Place: P; Package: *; Part Number: RMCF0402JT2K20; Power: *; Tolerance: *; Voltage: *; Operating Temp.: *
R_TERM = RES_GEN_SMD: RES 120 OHM 5% 1/2W 0805; Package: *; Part Number: ESR10EZPJ121; Power: *; Tolerance: 5 %; Voltage: *; Operating Temp.: *
U6 = M24256E-FMN6TP: IC EEPROM 256KBIT I2C 1MHZ 8SO; Manufacturer: STM; Voltage: 1.6V ~ 5.5V; Place: POP; Part Number: M24256E-FMN6TP; Value: 256Kbit; Power: N/A; Tolerance: N/A; Package: 8-SOIC; Operating Temp.: -40°C ~ 85°C
U7 = SP3082EEN-L: 1/1 Transceiver Half RS422, RS485 8-SOIC; Manufacturer: MaxLinear, Inc.; Value: 256nodes; Voltage: 4.5V ~ 5.5V; Place: POP; Part Number: SP3082EEN-L; Power: N/A; Tolerance: N/A; Package: 8-SOIC; Operating Temp.: -40°C ~ 85°C